# EAGLE board GTA04b7 (EAGLE 7.6.0), part 1 of 4
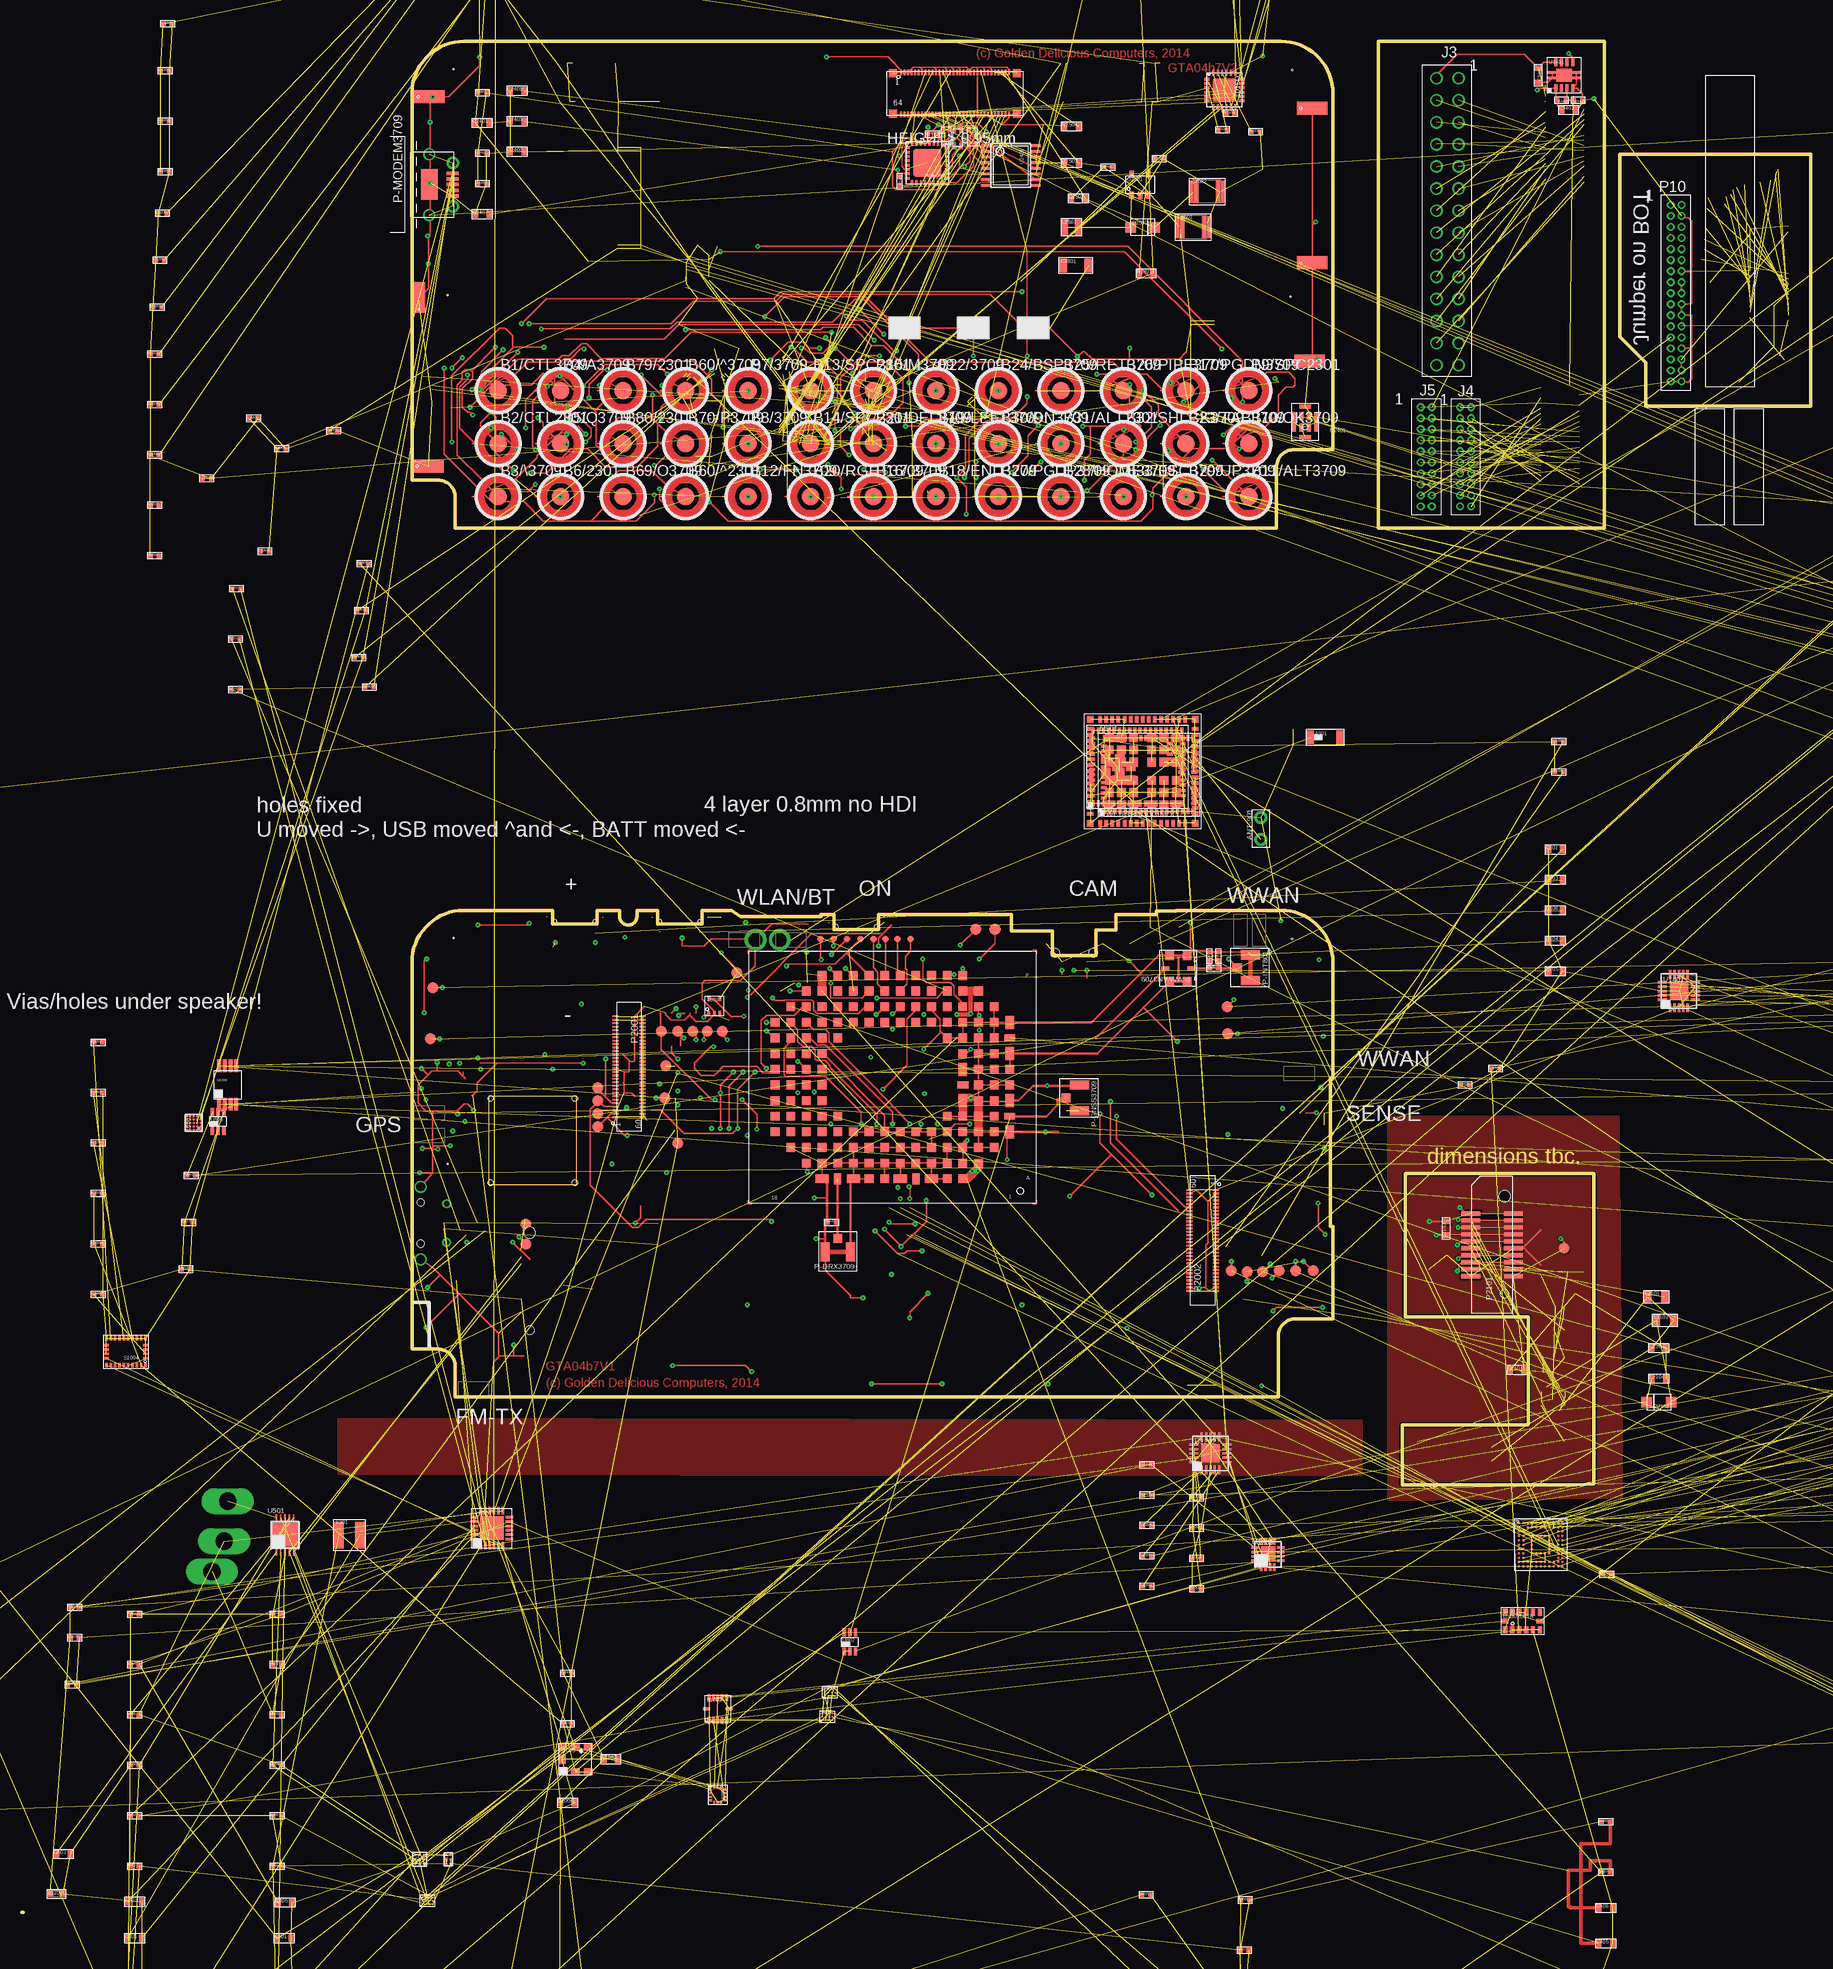
[diagram p42: board, top side]
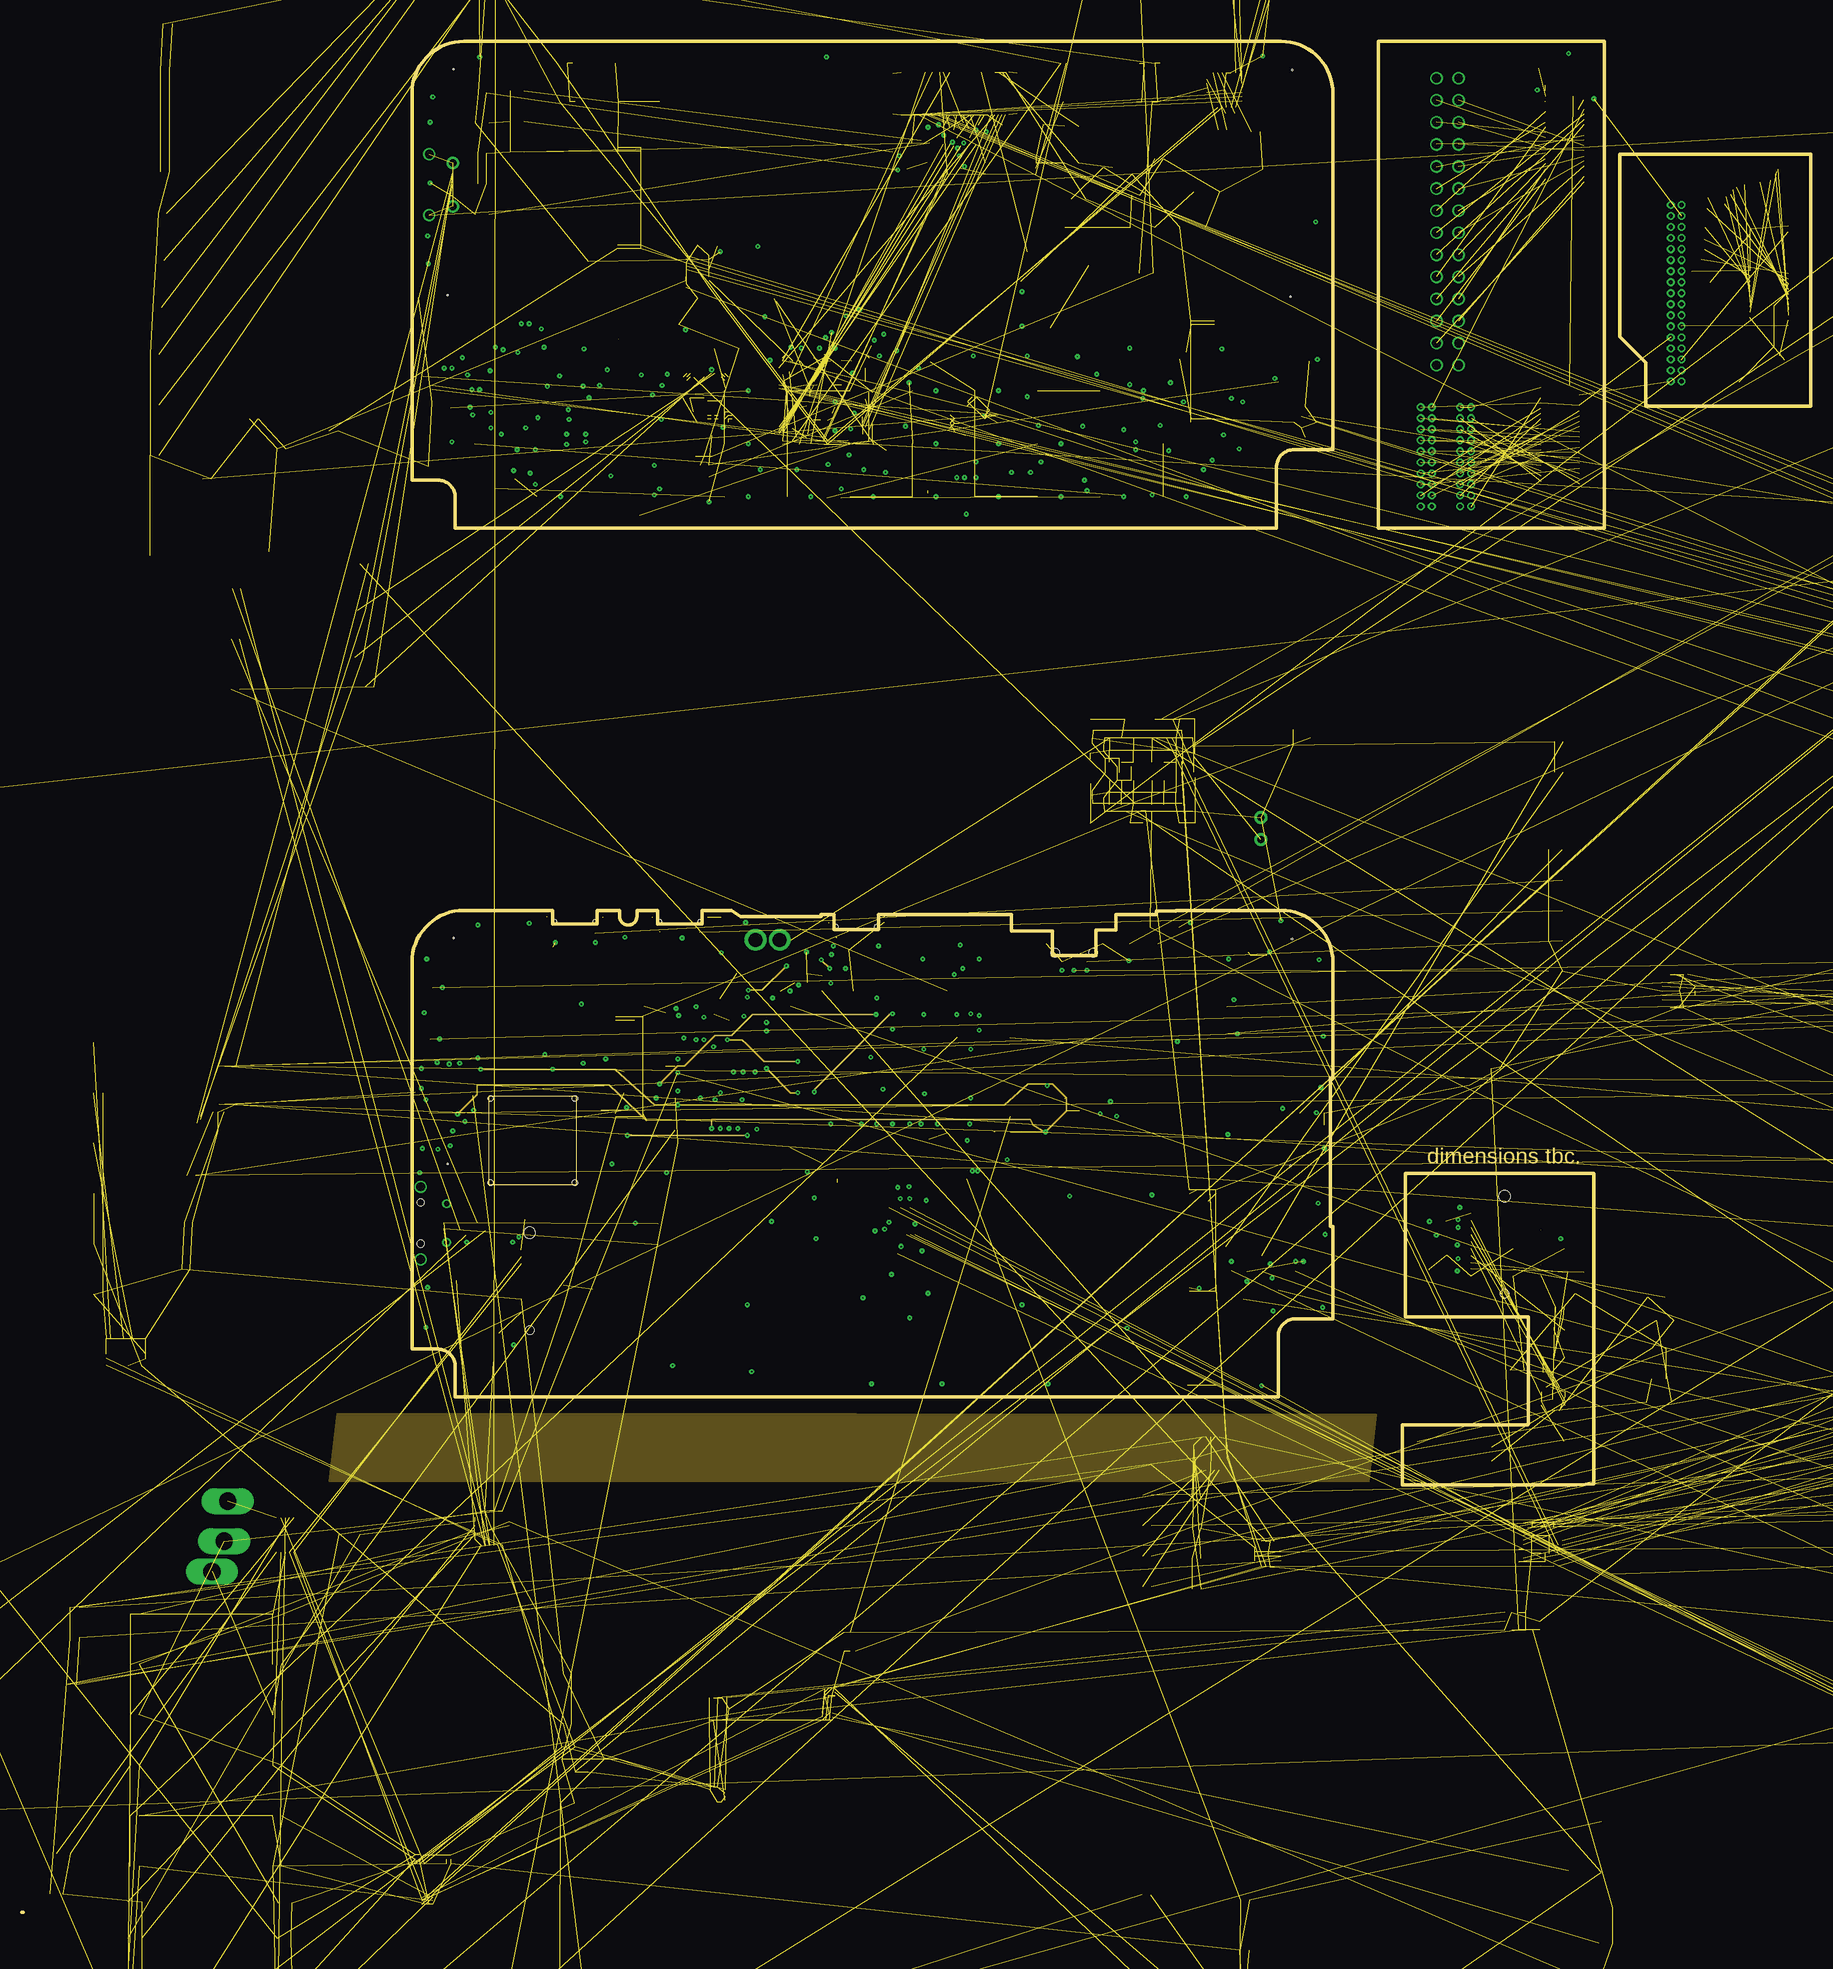
[diagram p43: board, inner layer Route2]
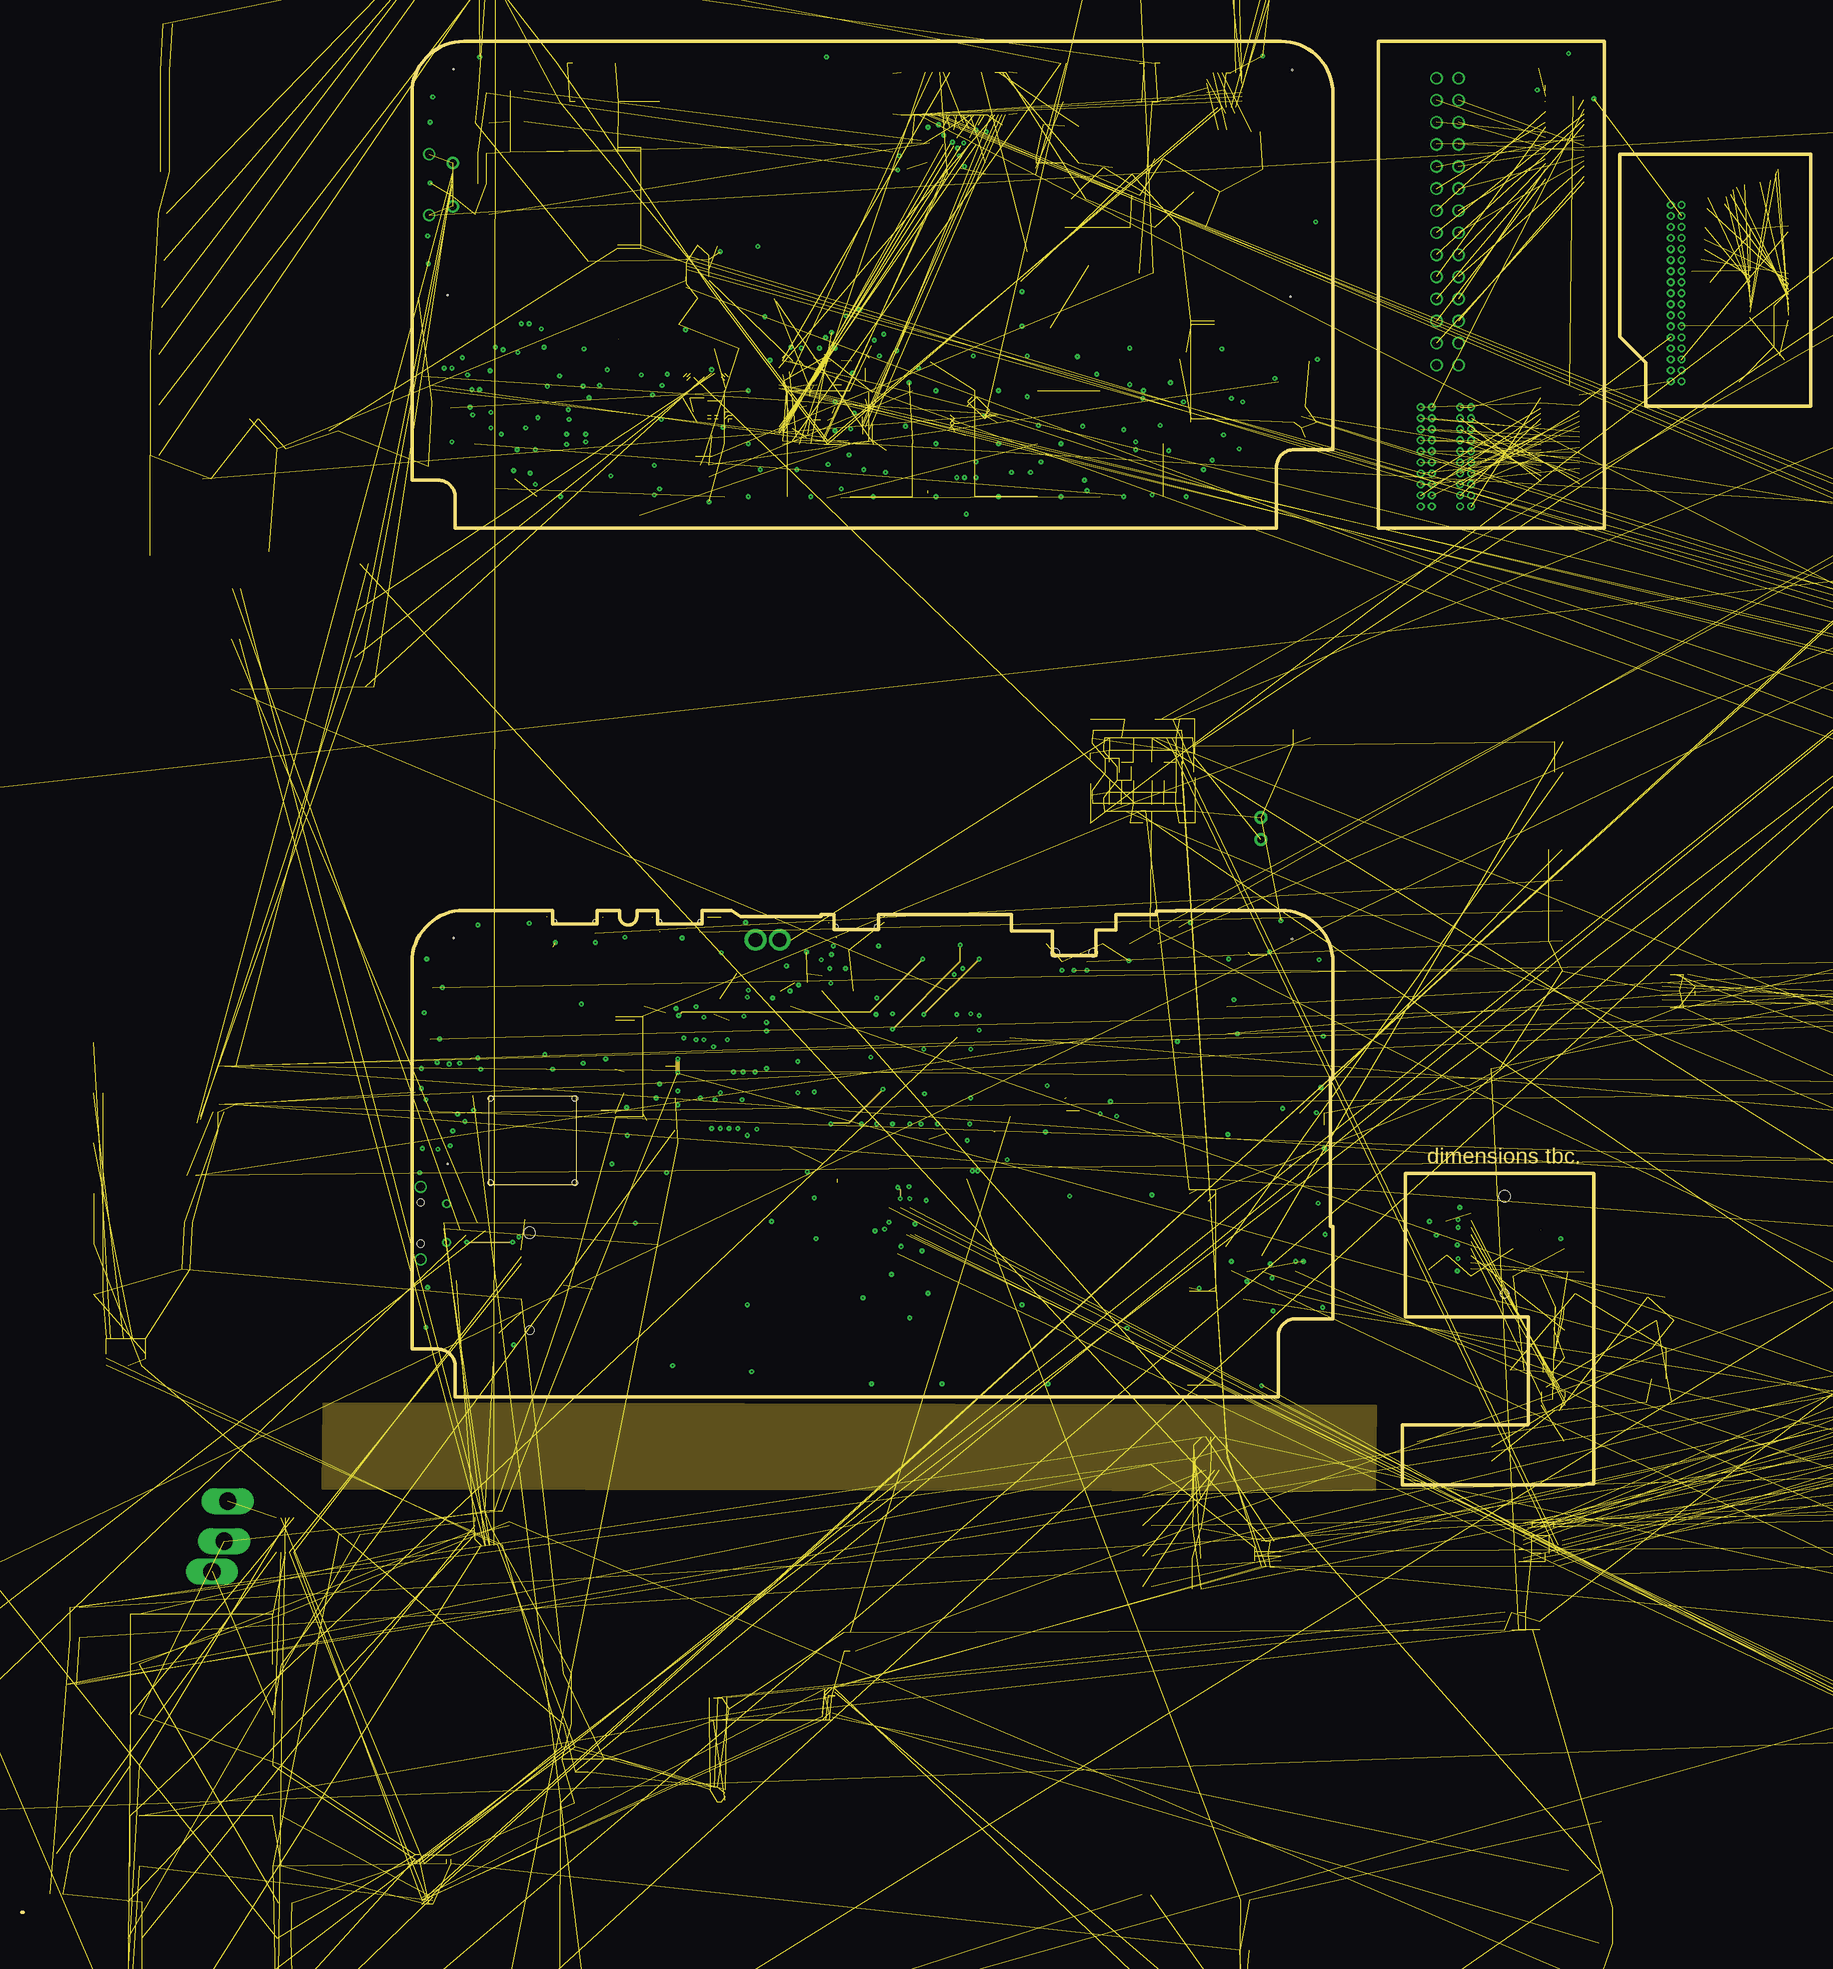
[diagram p44: board, inner layer Route15]
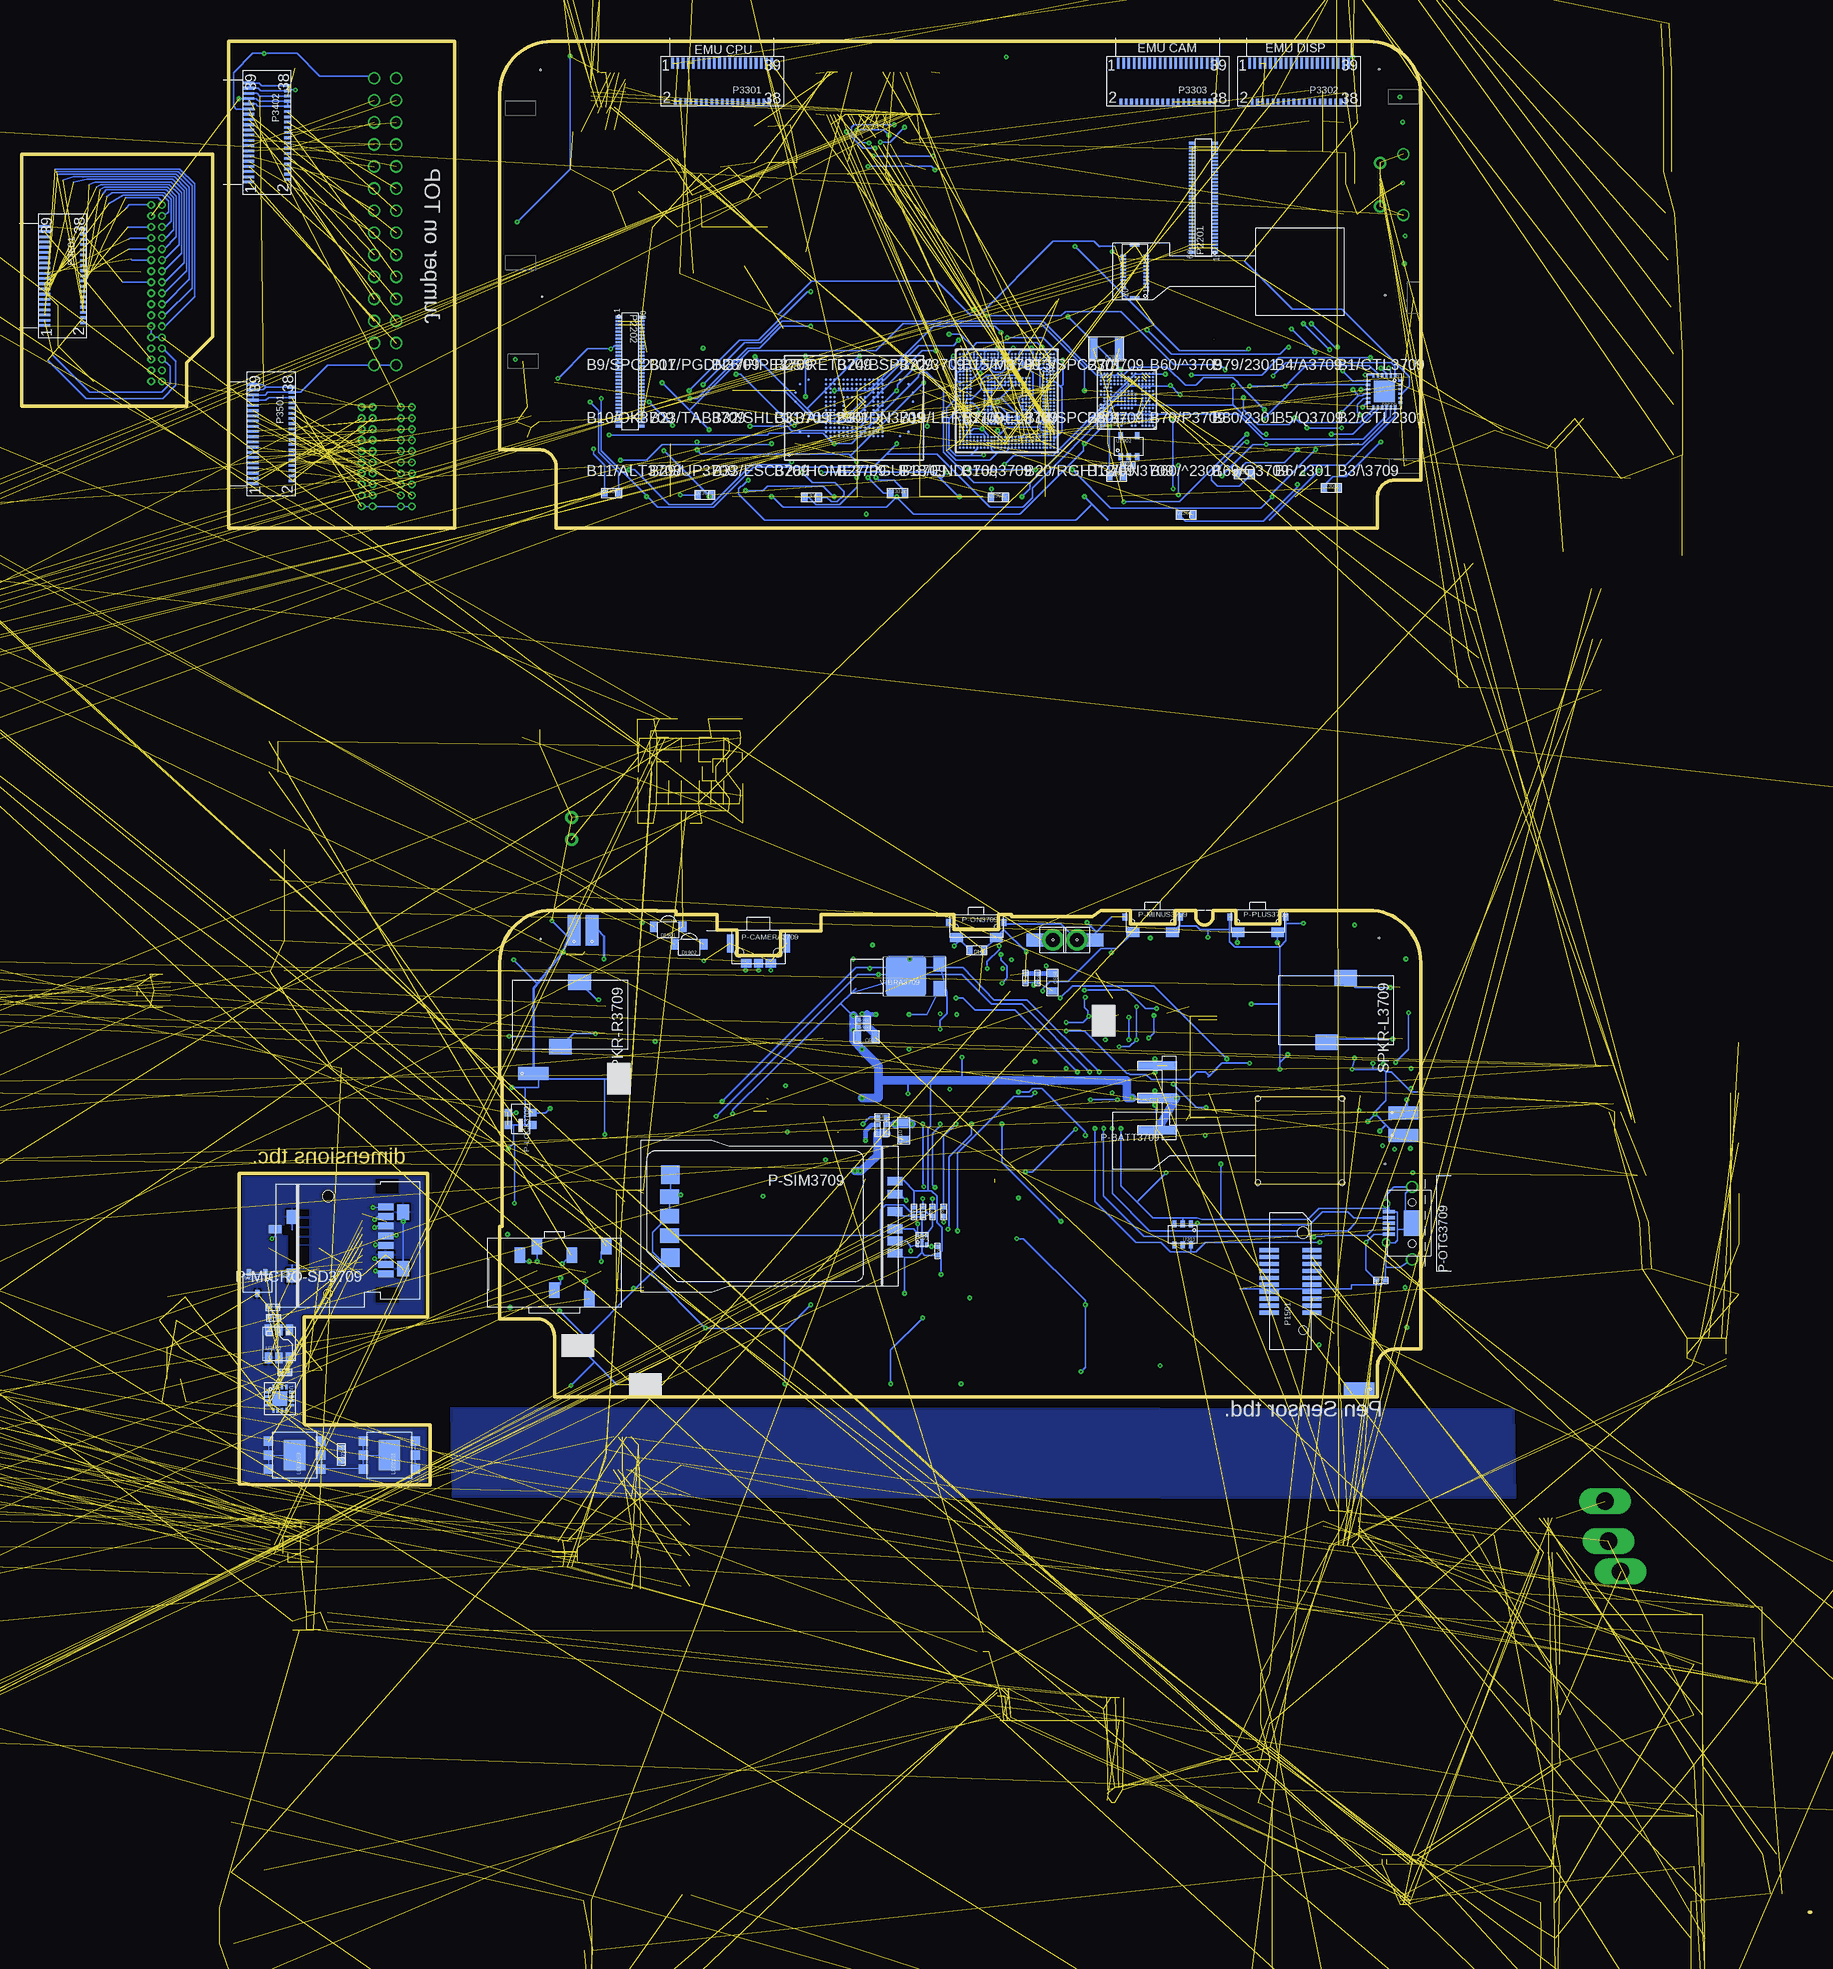
[diagram p45: board, bottom side, seen from below]

Size 205.9 x 215.3 mm. Coordinates in mm from the lower left corner, seen from the top.
Outline: 0,0 0.2,0
Outline: 49.9,59.3 144.6,59.3 144.6,66.3 arc-90 146.6,68.3 150.9,68.3 150.9,78.9 150.6,78.9 150.6,96 150.9,96 150.9,109.3 arc90 144.9,115.3 132.8,115.3 132.8,115.2 130.6,115.2 130.6,114.8 125.9,114.8 125.9,113 123.6,113 123.6,110.1 118.6,110.1 118.6,112.9 113.9,112.9 113.9,114.8 98.6,114.8 98.6,113.1 93.5,113.1 93.5,114.8 92,114.8 92,114.6 82.7,114.6 81.7,115.3 78.3,115.3 78.3,113.7 73.2,113.7 73.2,115.3 70.8,115.3 70.8,114.6 arc-180 68.8,114.6 68.8,115.3 66.2,115.3 66.2,113.7 61.1,113.7 61.1,115.3 50.9,115.3 arc90 44.9,109.3 44.9,64.8 47.9,64.8 arc-90 49.9,62.8 49.9,59.3
Outline: 159.2,85 180.9,85 180.9,49.3 178.9,49.2 158.9,49.2 158.9,56.1 173.3,56.1 173.4,56.2 173.4,68.5 159.2,68.5 159.2,85
Outline: 49.9,159.3 144.4,159.3 144.4,166.3 arc-90 146.4,168.3 150.9,168.3 150.9,209.3 arc90 144.9,215.3 50.9,215.3 arc90 44.9,209.3 44.9,164.8 47.9,164.8 arc-90 49.9,162.8 49.9,159.3
Outline: 156.1,215.3 182.1,215.3 182.1,159.3 156.1,159.3 156.1,215.3
Outline: 186.9,173.3 186.9,178.3 183.9,181.3 183.9,202.3 205.9,202.3 205.9,173.3 186.9,173.3
Copper layers (1*2*15*16): Top 0.035mm / dielectric 0.065mm / Route2 0.035mm / dielectric 0.53mm / Route15 0.035mm / dielectric 0.065mm / Bottom 0.035mm
Design rules "Würth *": minimum track width 0.1mm, minimum drill 0.25mm, track to track 0.1mm, track to pad 0.15mm, pad to pad 0.15mm, via to via 0.15mm, smd to smd 0.15mm, copper to edge 0.15mm, drill to drill 0.15mm, minimum pad ring 0.2mm, minimum via ring 0.2mm, stop-mask expansion 4mil, vias tented up to drill 0.4mm, thermal gap 10mil
Net classes: 2 50 Ohm: width 0.27 mm, clearance 0.27 mm; 3 90 Ohm: width 0.15 mm, clearance 0.27 mm; 4 GND: width 0.2 mm; 5 Battery: width 0.3 mm; 6 FM Antenna: width 0.27 mm; 7 VBUS: width 0.25 mm
Holes 0.15 mm at 49.7,112.1 146.2,112 146,85.9 49,86.1 49.7,212.1 146.2,212 146,185.9 49,186.1
tKeepout: area 94.4,180.7 to 115.4,203.7; area 115.4,180.7 to 140.4,212.7
bKeepout: area 51.4,59.3 to 144.4,63.8; area 47.1,110.7 to 51.3,113.7; area 68.6,109.5 to 71.2,114.6; area 52.3,110.6 to 59.2,114.8; area 45.7,87.7 to 49.2,94.4; area 81.1,110.1 to 91.9,114.4; area 100.3,108.6 to 101.1,114.3; area 112.5,109.1 to 113.2,114.4; area 127,109.2 to 127.6,114.4; area 127.6,109.2 to 133.1,110; area 133.1,109.7 to 134,115; area 137.7,110.3 to 145.1,114.8; area 47.8,84.1 to 51.4,87.7; area 45.2,69.9 to 48.2,70.6; area 49.6,87.9 to 50.1,101.5; area 136.5,68.3 to 150.8,78.9; area 135.2,99 to 150.1,107.9; area 47.3,99.1 to 61.8,108.5; area 140.1,80.1 to 150.4,100.2; area 106.4,71.1 to 123.4,72.1; area 106.4,88.1 to 123.4,89.1; area 82.9,181.3 to 116.9,211.3

## Footprints (pad centres in the part's own frame; a part is rotated, then mirrored left to right if it is on the bottom)
TP-0.75 = smd 0.75 x 0.75: P 0,0
2450AT18A100 = smd 0.8 x 1.6: ANT 0.4,0; NC 3.8,0 | smd 0.2 x 0.2: GND1 -1.6,0.9; GND2 -1.6,-0.9
2PIN2.54 = drill 0.8 pad 1.5: 1 -1.27,0; 2 1.27,0
N900-BUTTON = smd 2 x 2 rotated 60: P$1 0,0 | smd 0.7 x 0.2: P$2 -2.7,0
TP-1.25 = smd 1.25 x 1.25: P 0,0
1PIN-HOLE = drill 2 pad 3 long: P$1 0,0
SMD-0402 = smd 0.5 x 0.5: 1 -0.5,0; 2 0.5,0
SMD-0603 = smd 0.6 x 0.85: 1 -0.8,0; 2 0.8,0
SMD-0805 = smd 0.8 x 1.3: 1 -1,0; 2 1,0
MK325 = smd 1 x 2.5: 1 -1.5,0; 2 1.5,0
SMD-1206 = smd 0.9 x 1.6: 1 -1.45,0; 2 1.45,0
SMD-1210 = smd 0.9 x 2.5: 1 -1.45,0; 2 1.45,0
SMD-0603D = smd 0.6 x 0.85: A -0.8,0; K 0.8,0
VSMB2948SL = smd 0.9 x 1.2: A 1.65,0; K -1.65,0
CRS02 = smd 1.2 x 1.2: A -1.4,0; K 1.4,0
N900-SPRING-A = smd 3.5 x 1.5: 1 0,0
PAD-3.5X2.5 = smd 3.5 x 2.5: 1 0,0
SMD-1212 = smd 1.1 x 3: 1 -1.2,0; 2 1.2,0
MPZ1608 = smd 0.6 x 0.8: 1 -0.7,0; 2 0.7,0
LB2016 = smd 0.7 x 1.8: 1 -0.75,0; 2 0.75,0
ACM2012H = smd 0.75 x 0.4: 1 -0.925,0.4; 2 -0.925,-0.4; 3 0.925,-0.4; 4 0.925,0.4
SMD-0806 = smd 0.8 x 1.6: 1 -1,0; 2 1,0
CLN6A = smd 1.1 x 1.1: 1 -3,1.6; 2 -3,0; 3 -3,-1.6; 4 3,-1.6; 5 3,0; 6 3,1.6 | smd 2.5 x 3.5: HS 0,0
SMLP36RGB2W3 = smd 0.45 x 0.45: 1 -0.675,-0.425; 3 0.675,-0.425; 4 0.675,0.425; 6 -0.675,0.425 | smd 0.4 x 0.45: 2 0,-0.425; 5 0,0.425
MSL0201RGB = smd 0.6 x 0.9: 1 1.35,0.15; 4 -1.35,0.15 | smd 0.5 x 0.9: 2 0.4,0; 3 -0.4,0
P*S8 = smd 1 x 1: A4 8.1,-11.7; A5 6.3,-11.7; A9 -0.9,-11.7; A10 -2.7,-11.7; B3 9.9,-9.9; B4 8.1,-9.9; B5 6.3,-9.9; B6 4.5,-9.9; B7 2.7,-9.9; B8 0.9,-9.9; B9 -0.9,-9.9; B10 -2.7,-9.9; B11 -4.5,-9.9; B12 -6.3,-9.9; B13 -8.1,-9.9; B14 -9.9,-9.9; C2 11.7,-8.1; C3 9.9,-8.1; C4 8.1,-8.1; C5 6.3,-8.1; C6 4.5,-8.1; C7 2.7,-8.1; C8 0.9,-8.1; C9 -0.9,-8.1; C10 -2.7,-8.1; C11 -4.5,-8.1; C12 -6.3,-8.1; C13 -8.1,-8.1; C14 -9.9,-8.1; C15 -11.7,-8.1; D2 11.7,-6.3; D3 9.9,-6.3; D4 8.1,-6.3; D5 6.3,-6.3; D6 4.5,-6.3; D7 2.7,-6.3; D8 0.9,-6.3; D9 -0.9,-6.3; D10 -2.7,-6.3; D11 -4.5,-6.3; D12 -6.3,-6.3; D13 -8.1,-6.3; D14 -9.9,-6.3; D15 -11.7,-6.3; D16 -13.5,-6.3; E2 11.7,-4.5; E3 9.9,-4.5; E4 8.1,-4.5; E5 6.3,-4.5; E12 -6.3,-4.5; E13 -8.1,-4.5; E14 -9.9,-4.5; E15 -11.7,-4.5; E16 -13.5,-4.5; F2 11.7,-2.7; F3 9.9,-2.7; F13 -8.1,-2.7; F14 -9.9,-2.7; F15 -11.7,-2.7; F16 -13.5,-2.7; G1 13.5,-0.9; G2 11.7,-0.9; G3 9.9,-0.9; G13 -8.1,-0.9; G14 -9.9,-0.9; G15 -11.7,-0.9; G16 -13.5,-0.9; H1 13.5,0.9; H2 11.7,0.9; H3 9.9,0.9; H13 -8.1,0.9; H14 -9.9,0.9; H15 -11.7,0.9; H16 -13.5,0.9; J2 11.7,2.7; J3 9.9,2.7; J4 8.1,2.7; J13 -8.1,2.7; J14 -9.9,2.7; J15 -11.7,2.7; J16 -13.5,2.7; K2 11.7,4.5; K3 9.9,4.5; K4 8.1,4.5; K5 6.3,4.5; K12 -6.3,4.5; K13 -8.1,4.5; K14 -9.9,4.5; K15 -11.7,4.5; K16 -13.5,4.5; L2 11.7,6.3; L3 9.9,6.3; L4 8.1,6.3; L5 6.3,6.3; L6 4.5,6.3; L7 2.7,6.3; L8 0.9,6.3; L9 -0.9,6.3; L10 -2.7,6.3; L11 -4.5,6.3; L12 -6.3,6.3; L13 -8.1,6.3; L14 -9.9,6.3; L15 -11.7,6.3; L16 -13.5,6.3; M2 11.7,8.1; M3 9.9,8.1; M4 8.1,8.1; M5 6.3,8.1; M6 4.5,8.1; M7 2.7,8.1; M8 0.9,8.1; M9 -0.9,8.1; M10 -2.7,8.1; M11 -4.5,8.1; M12 -6.3,8.1; M13 -8.1,8.1; M14 -9.9,8.1; M15 -11.7,8.1; N3 9.9,9.9; N4 8.1,9.9; N5 6.3,9.9; N6 4.5,9.9; N7 2.7,9.9; N8 0.9,9.9; N9 -0.9,9.9; N10 -2.7,9.9; N11 -4.5,9.9; N12 -6.3,9.9; N13 -8.1,9.9; N14 -9.9,9.9; P4 8.1,11.7; P5 6.3,11.7; P6 4.5,11.7; P7 2.7,11.7; P8 0.9,11.7; P9 -0.9,11.7; P10 -2.7,11.7; P11 -4.5,11.7; P12 -6.3,11.7; P13 -8.1,11.7 | smd 1.5 x 1: A6 4.5,-11.7; A8 0.9,-11.7; A11 -4.5,-11.7; A13 -8.1,-11.7 | smd 0.8 x 1.25: A7 2.7,-11.7; A12 -6.3,-11.7 | smd 1 x 1.5: D1 13.5,-6.3; F1 13.5,-2.7; F4 8.1,-2.7; H4 8.1,0.9; J1 13.5,2.7; L1 13.5,6.3 | smd 1.25 x 0.8: E1 13.5,-4.5; G4 8.1,-0.9; K1 13.5,4.5
WL18XXMOD = smd 0.75 x 0.75: 1 -6.025,-5.975; 17 6.025,-5.975; 33 6.025,5.975; 49 -6.025,5.975 | smd 0.4 x 0.75: 2 -4.9,-5.975; 3 -4.2,-5.975; 4 -3.5,-5.975; 5 -2.8,-5.975; 6 -2.1,-5.975; 7 -1.4,-5.975; 8 -0.7,-5.975; 9 0,-5.975; 10 0.7,-5.975; 11 1.4,-5.975; 12 2.1,-5.975; 13 2.8,-5.975; 14 3.5,-5.975; 15 4.2,-5.975; 16 4.9,-5.975; 34 4.9,5.975; 35 4.2,5.975; 36 3.5,5.975; 37 2.8,5.975; 38 2.1,5.975; 39 1.4,5.975; 40 0.7,5.975; 41 0,5.975; 42 -0.7,5.975; 43 -1.4,5.975; 44 -2.1,5.975; 45 -2.8,5.975; 46 -3.5,5.975; 47 -4.2,5.975; 48 -4.9,5.975 | smd 0.75 x 0.4: 18 6.025,-4.9; 19 6.025,-4.2; 20 6.025,-3.5; 21 6.025,-2.8; 22 6.025,-2.1; 23 6.025,-1.4; 24 6.025,-0.7; 25 6.025,0; 26 6.025,0.7; 27 6.025,1.4; 28 6.025,2.1; 29 6.025,2.8; 30 6.025,3.5; 31 6.025,4.2; 32 6.025,4.9; 50 -6.025,4.9; 51 -6.025,4.2; 52 -6.025,3.5; 53 -6.025,2.8; 54 -6.025,2.1; 55 -6.025,1.4; 56 -6.025,0.7; 57 -6.025,0; 58 -6.025,-0.7; 59 -6.025,-1.4; 60 -6.025,-2.1; 61 -6.025,-2.8; 62 -6.025,-3.5; 63 -6.025,-4.2; 64 -6.025,-4.9 | smd 1 x 1: G1 -3.85,-3.85; G2 -2.45,-3.85; G3 -1.05,-3.85; G4 1.05,-3.85; G5 2.45,-3.85; G6 3.85,-3.85; G7 -3.85,-2.45; G8 -2.45,-2.45; G9 -1.05,-2.45; G10 1.05,-2.45; G11 2.45,-2.45; G12 3.85,-2.45; G13 -3.85,-1.05; G14 -2.45,-1.05; G15 -1.05,-1.05; G16 1.05,-1.05; G17 2.45,-1.05; G18 3.85,-1.05; G19 -3.85,1.05; G20 -2.45,1.05; G21 -1.05,1.05; G22 1.05,1.05; G23 2.45,1.05; G24 3.85,1.05; G25 -3.85,2.45; G26 -2.45,2.45; G27 -1.05,2.45; G28 1.05,2.45; G29 2.45,2.45; G30 3.85,2.45; G31 -3.85,3.85; G32 -2.45,3.85; G33 -1.05,3.85; G34 1.05,3.85; G35 2.45,3.85; G36 3.85,3.85
JORJIN-WG7351 = smd 0.35 x 0.7: 1 -5.1,-4.2; 2 -4.5,-4.2; 3 -3.9,-4.2; 4 -3.3,-4.2; 5 -2.7,-4.2; 6 -2.1,-4.2; 7 -1.5,-4.2; 8 -0.9,-4.2; 9 -0.3,-4.2; 10 0.3,-4.2; 11 0.9,-4.2; 12 1.5,-4.2; 13 2.1,-4.2; 14 2.7,-4.2; 15 3.3,-4.2; 16 3.9,-4.2; 17 4.5,-4.2; 18 5.1,-4.2; 31 5.1,4.2; 32 4.5,4.2; 33 3.9,4.2; 34 3.3,4.2; 35 2.7,4.2; 36 2.1,4.2; 37 1.5,4.2; 38 0.9,4.2; 39 0.3,4.2; 40 -0.3,4.2; 41 -0.9,4.2; 42 -1.5,4.2; 43 -2.1,4.2; 44 -2.7,4.2; 45 -3.3,4.2; 46 -3.9,4.2; 47 -4.5,4.2; 48 -5.1,4.2 | smd 0.63 x 0.35: 19 5.2,-3.3; 20 5.2,-2.7; 21 5.2,-2.1; 22 5.2,-1.5; 23 5.2,-0.9; 24 5.2,-0.3; 25 5.2,0.3; 26 5.2,0.9; 27 5.2,1.5; 28 5.2,2.1; 29 5.2,2.7; 30 5.2,3.3; 49 -5.2,3.3; 50 -5.2,2.7; 51 -5.2,2.1; 52 -5.2,1.5; 53 -5.2,0.9; 54 -5.2,0.3; 55 -5.2,-0.3; 56 -5.2,-0.9; 57 -5.2,-1.5; 58 -5.2,-2.1; 59 -5.2,-2.7; 60 -5.2,-3.3 | smd 0.7 x 0.35: 61 3.735,0.3; 62 3.735,0.9; 63 3.735,1.5; 64 3.735,2.1; 65 3.735,2.7 | smd 1.1 x 1.1: 66 -3.665,-0.65; 67 -2.065,-0.65; 68 -2.065,0.95; 69 -3.665,0.95
SPK0415HM4H-B = smd 0.45 x 0.95: 1 0.425,-0.675; 2 0.425,0.675; 3 -0.425,0.675; 4 -0.425,-0.675 | smd 1.3 x 0.45: 5 0,-1.775; 7 0,1.775 | smd 0.45 x 2.3: 6 1.275,0; 8 -1.275,0
0R = smd 0.2 x 0.2: P$1 -0.15,0; P$2 0.15,0
N97-CAMERA = hole 0.6: -4.85,4.85; 4.85,4.85; 4.85,-4.85; -4.85,-4.85
FX6-20S-0.8SV = smd 0.5 x 2.2: 1 3.6,-2.45; 2 3.6,2.45; 3 2.8,-2.45; 4 2.8,2.45; 5 2,-2.45; 6 2,2.45; 7 1.2,-2.45; 8 1.2,2.45; 9 0.4,-2.45; 10 0.4,2.45; 11 -0.4,-2.45; 12 -0.4,2.45; 13 -1.2,-2.45; 14 -1.2,2.45; 15 -2,-2.45; 16 -2,2.45; 17 -2.8,-2.45; 18 -2.8,2.45; 19 -3.6,-2.45; 20 -3.6,2.45 | hole 1: -5.6,-1.45 | hole 1.3: 5.6,-1.45
DF40C-60DS-0.4V = smd 0.2 x 0.7: 1 5.8,-1.54; 2 5.4,-1.54; 3 5,-1.54; 4 4.6,-1.54; 5 4.2,-1.54; 6 3.8,-1.54; 7 3.4,-1.54; 8 3,-1.54; 9 2.6,-1.54; 10 2.2,-1.54; 11 1.8,-1.54; 12 1.4,-1.54; 13 1,-1.54; 14 0.6,-1.54; 15 0.2,-1.54; 16 -0.2,-1.54; 17 -0.6,-1.54; 18 -1,-1.54; 19 -1.4,-1.54; 20 -1.8,-1.54; 21 -2.2,-1.54; 22 -2.6,-1.54; 23 -3,-1.54; 24 -3.4,-1.54; 25 -3.8,-1.54; 26 -4.2,-1.54; 27 -4.6,-1.54; 28 -5,-1.54; 29 -5.4,-1.54; 30 -5.8,-1.54; 31 -5.8,1.54; 32 -5.4,1.54; 33 -5,1.54; 34 -4.6,1.54; 35 -4.2,1.54; 36 -3.8,1.54; 37 -3.4,1.54; 38 -3,1.54; 39 -2.6,1.54; 40 -2.2,1.54; 41 -1.8,1.54; 42 -1.4,1.54; 43 -1,1.54; 44 -0.6,1.54; 45 -0.2,1.54; 46 0.2,1.54; 47 0.6,1.54; 48 1,1.54; 49 1.4,1.54; 50 1.8,1.54; 51 2.2,1.54; 52 2.6,1.54; 53 3,1.54; 54 3.4,1.54; 55 3.8,1.54; 56 4.2,1.54; 57 4.6,1.54; 58 5,1.54; 59 5.4,1.54; 60 5.8,1.54
FX6-20P-0.8SV = smd 0.5 x 2.2: 1 3.6,2.45; 2 3.6,-2.45; 3 2.8,2.45; 4 2.8,-2.45; 5 2,2.45; 6 2,-2.45; 7 1.2,2.45; 8 1.2,-2.45; 9 0.4,2.45; 10 0.4,-2.45; 11 -0.4,2.45; 12 -0.4,-2.45; 13 -1.2,2.45; 14 -1.2,-2.45; 15 -2,2.45; 16 -2,-2.45; 17 -2.8,2.45; 18 -2.8,-2.45; 19 -3.6,2.45; 20 -3.6,-2.45 | hole 1: -5.6,-1.45 | hole 1.3: 5.6,-1.45
DF40C-60DP-0.4V = smd 0.23 x 0.66: 1 5.8,1.335; 2 5.4,1.335; 3 5,1.335; 4 4.6,1.335; 5 4.2,1.335; 6 3.8,1.335; 7 3.4,1.335; 8 3,1.335; 9 2.6,1.335; 10 2.2,1.335; 11 1.8,1.335; 12 1.4,1.335; 13 1,1.335; 14 0.6,1.335; 15 0.2,1.335; 16 -0.2,1.335; 17 -0.6,1.335; 18 -1,1.335; 19 -1.4,1.335; 20 -1.8,1.335; 21 -2.2,1.335; 22 -2.6,1.335; 23 -3,1.335; 24 -3.4,1.335; 25 -3.8,1.335; 26 -4.2,1.335; 27 -4.6,1.335; 28 -5,1.335; 29 -5.4,1.335; 30 -5.8,1.335; 31 -5.8,-1.335; 32 -5.4,-1.335; 33 -5,-1.335; 34 -4.6,-1.335; 35 -4.2,-1.335; 36 -3.8,-1.335; 37 -3.4,-1.335; 38 -3,-1.335; 39 -2.6,-1.335; 40 -2.2,-1.335; 41 -1.8,-1.335; 42 -1.4,-1.335; 43 -1,-1.335; 44 -0.6,-1.335; 45 -0.2,-1.335; 46 0.2,-1.335; 47 0.6,-1.335; 48 1,-1.335; 49 1.4,-1.335; 50 1.8,-1.335; 51 2.2,-1.335; 52 2.6,-1.335; 53 3,-1.335; 54 3.4,-1.335; 55 3.8,-1.335; 56 4.2,-1.335; 57 4.6,-1.335; 58 5,-1.335; 59 5.4,-1.335; 60 5.8,-1.335 | smd 0.35 x 0.66: M1 6.275,1.335; M2 -6.275,1.335; M3 -6.275,-1.335; M4 6.275,-1.335
DF37NB-20SD-0.4V = smd 0.23 x 0.63: 1 -1.8,-1.325; 2 -1.4,-1.325; 3 -1,-1.325; 4 -0.6,-1.325; 5 -0.2,-1.325; 6 0.2,-1.325; 7 0.6,-1.325; 8 1,-1.325; 9 1.4,-1.325; 10 1.8,-1.325; 11 1.8,1.325; 12 1.4,1.325; 13 1,1.325; 14 0.6,1.325; 15 0.2,1.325; 16 -0.2,1.325; 17 -0.6,1.325; 18 -1,1.325; 19 -1.4,1.325; 20 -1.8,1.325 | smd 0.38 x 1.1: M1 -3.04,0; M2 3.04,0
FH23-39S-0.3SHW(0.5) = smd 0.3 x 1.25: 1 5.7,-2.062; 3 5.1,-2.062; 5 4.5,-2.062; 7 3.9,-2.062; 9 3.3,-2.062; 11 2.7,-2.062; 13 2.1,-2.062; 15 1.5,-2.062; 17 0.9,-2.062; 19 0.3,-2.062; 21 -0.3,-2.062; 23 -0.9,-2.062; 25 -1.5,-2.062; 27 -2.1,-2.062; 29 -2.7,-2.062; 31 -3.3,-2.062; 33 -3.9,-2.062; 35 -4.5,-2.062; 37 -5.1,-2.062; 39 -5.7,-2.062 | smd 0.3 x 0.7: 2 5.4,2.362; 4 4.8,2.362; 6 4.2,2.362; 8 3.6,2.362; 10 3,2.362; 12 2.4,2.362; 14 1.8,2.362; 16 1.2,2.362; 18 0.6,2.362; 20 0,2.362; 22 -0.6,2.362; 24 -1.2,2.362; 26 -1.8,2.362; 28 -2.4,2.362; 30 -3,2.362; 32 -3.6,2.362; 34 -4.2,2.362; 36 -4.8,2.362; 38 -5.4,2.362
BEAGLEBOARD = drill 1.02: J3$1 1.45,-37.85; J3$2 3.99,-37.85; J3$3 1.45,-35.31; J3$4 3.99,-35.31; J3$5 1.45,-32.77; J3$6 3.99,-32.77; J3$7 1.45,-30.23; J3$8 3.99,-30.23; J3$9 1.45,-27.69; J3$10 3.99,-27.69; J3$11 1.45,-25.15; J3$12 3.99,-25.15; J3$13 1.45,-22.61; J3$14 3.99,-22.61; J3$15 1.45,-20.07; J3$16 3.99,-20.07; J3$17 1.45,-17.53; J3$18 3.99,-17.53; J3$19 1.45,-14.99; J3$20 3.99,-14.99; J3$21 1.45,-12.45; J3$22 3.99,-12.45; J3$23 1.45,-9.91; J3$24 3.99,-9.91; J3$25 1.45,-7.37; J3$26 3.99,-7.37; J3$27 1.45,-4.83; J3$28 3.99,-4.83 | drill 0.5: J4$1 1.27,0; J4$2 0,0; J4$3 1.27,1.27; J4$4 0,1.27; J4$5 1.27,2.54; J4$6 0,2.54; J4$7 1.27,3.81; J4$8 0,3.81; J4$9 1.27,5.08; J4$10 0,5.08; J4$11 1.27,6.35; J4$12 0,6.35; J4$13 1.27,7.62; J4$14 0,7.62; J4$15 1.27,8.89; J4$16 0,8.89; J4$17 1.27,10.16; J4$18 0,10.16; J4$19 1.27,11.43; J4$20 0,11.43; J5$1 5.8,0; J5$2 4.53,0; J5$3 5.8,1.27; J5$4 4.53,1.27; J5$5 5.8,2.54; J5$6 4.53,2.54; J5$7 5.8,3.81; J5$8 4.53,3.81; J5$9 5.8,5.08; J5$10 4.53,5.08; J5$11 5.8,6.35; J5$12 4.53,6.35; J5$13 5.8,7.62; J5$14 4.53,7.62; J5$15 5.8,8.89; J5$16 4.53,8.89; J5$17 5.8,10.16; J5$18 4.53,10.16; J5$19 5.8,11.43; J5$20 4.53,11.43
BEAGLEBOARD-XM-CAM = drill 0.5: P10$1 9.63,-24.47; P10$2 8.4,-24.47; P10$3 9.63,-23.2; P10$4 8.4,-23.2; P10$5 9.63,-21.93; P10$6 8.4,-21.93; P10$7 9.63,-20.66; P10$8 8.4,-20.66; P10$9 9.63,-19.39; P10$10 8.4,-19.39; P10$11 9.63,-18.12; P10$12 8.4,-18.12; P10$13 9.63,-16.85; P10$14 8.4,-16.85; P10$15 9.63,-15.58; P10$16 8.4,-15.58; P10$17 9.63,-14.31; P10$18 8.4,-14.31; P10$19 9.63,-13.04; P10$20 8.4,-13.04; P10$21 9.63,-11.77; P10$22 8.4,-11.77; P10$23 9.63,-10.5; P10$24 8.4,-10.5; P10$25 9.63,-9.23; P10$26 8.4,-9.23; P10$27 9.63,-7.96; P10$28 8.4,-7.96; P10$29 9.63,-6.69; P10$30 8.4,-6.69; P10$31 9.63,-5.42; P10$32 8.4,-5.42; P10$33 9.63,-4.15; P10$34 8.4,-4.15
N900-BATTCONN = smd 4.5 x 1: BATT1 0,3.7; BATT2 0,0; BATT3 0,-3.7
EVQQ0 = smd 1.2 x 1: 1 -1.4,-0.9; 3 1.4,-0.9 | smd 1 x 1: 2 0,-0.9 | smd 0.7 x 2.05: S1 -3.25,1.375; S2 3.25,1.375 | hole 1: -2.2,0.3; 2.2,0.3
500024-6471 = smd 0.23 x 0.65: 1 6.2,-2.425; 2 5.8,-2.425; 3 5.4,-2.425; 4 5,-2.425; 5 4.6,-2.425; 6 4.2,-2.425; 7 3.8,-2.425; 8 3.4,-2.425; 9 3,-2.425; 10 2.6,-2.425; 11 2.2,-2.425; 12 1.8,-2.425; 13 1.4,-2.425; 14 1,-2.425; 15 0.6,-2.425; 16 0.2,-2.425; 17 -0.2,-2.425; 18 -0.6,-2.425; 19 -1,-2.425; 20 -1.4,-2.425; 21 -1.8,-2.425; 22 -2.2,-2.425; 23 -2.6,-2.425; 24 -3,-2.425; 25 -3.4,-2.425; 26 -3.8,-2.425; 27 -4.2,-2.425; 28 -4.6,-2.425; 29 -5,-2.425; 30 -5.4,-2.425; 31 -5.8,-2.425; 32 -6.2,-2.425; 33 -6.2,2.425; 34 -5.8,2.425; 35 -5.4,2.425; 36 -5,2.425; 37 -4.6,2.425; 38 -4.2,2.425; 39 -3.8,2.425; 40 -3.4,2.425; 41 -3,2.425; 42 -2.6,2.425; 43 -2.2,2.425; 44 -1.8,2.425; 45 -1.4,2.425; 46 -1,2.425; 47 -0.6,2.425; 48 -0.2,2.425; 49 0.2,2.425; 50 0.6,2.425; 51 1,2.425; 52 1.4,2.425; 53 1.8,2.425; 54 2.2,2.425; 55 2.6,2.425; 56 3,2.425; 57 3.4,2.425; 58 3.8,2.425; 59 4.2,2.425; 60 4.6,2.425; 61 5,2.425; 62 5.4,2.425; 63 5.8,2.425; 64 6.2,2.425 | smd 0.9 x 0.9: M1 -7.12,-2.32; M2 -7.12,2.32; M3 7.12,-2.32; M4 7.12,2.32
U.FL-SOCKET-SMT-HIROSE = smd 1.05 x 2.2: GND1 -1.475,0; GND2 1.475,0 | smd 1 x 1.05: SIG 0,-1.525
N900-HEADSET = smd 1.2 x 1.8: 1 -6,-3; 2 -4,3; 3 -2,-2; 4 0,2; 5 2,-3; 6 4,-2
ESE-16J001 = smd 0.9 x 0.9: 1 -0.7,1.4; 2 0.7,1.4; 3 -0.7,-1.4; 4 0.7,-1.4
ST1W008S4BR1500 = smd 1.8 x 0.8: 1 -4,-3.85; 2 -4,-2.75; 3 -4,-1.65; 4 -4,-0.55; 5 -4,0.55; 6 -4,1.65; 7 -4,2.75; 8 -4,3.85 | smd 1.4 x 1.8: S1 -6,3.25; S2 -6,-3.25 | smd 1.2 x 1.6: S3 6.8,4; S4 6.8,-2.7 | smd 1.5 x 1: SW 8.75,-1.3
EVQP40B3M = smd 1.45 x 1.05: 1 -2.275,-0.925; 2 2.275,-0.925 | smd 0.6 x 0.8: S1 -3.2,0.8; S2 3.2,0.8 | hole 0.5: -2.35,0.3; 2.35,0.3
105017-0001 = smd 0.4 x 1.35: 1/VBUS 1.3,-2.7; 2/D- 0.65,-2.7; 3/D+ 0,-2.7; 4/ID -0.65,-2.7; 5/GND -1.3,-2.7 | smd 3.5 x 1.9: MOUNT 0,0 | drill 0.85 pad 1.45: SH1 -2.5,-2.7; SH2 2.5,-2.7 | drill 1 pad 1.3: SH3 -3.5,0; SH4 3.5,0
SD-47590-0001 = smd 0.4 x 1.35: 1/VBUS 1.3,-2.675; 2/D- 0.65,-2.675; 3/D+ 0,-2.675; 4/ID -0.65,-2.675; 5/GND -1.3,-2.675 | smd 2.9 x 1.9: MOUNT 0,0 | drill 0.6 pad 0.8: SH1 -2.225,-3; SH2 2.225,-3 | drill 1 pad 1.3: SH3 -4.175,0; SH4 4.175,0 | hole 0.85: -2.375,0; 2.375,0
SJ106220 = smd 1.7 x 1: C1 12.11,2.54; C2 12.11,0.54; C3 12.11,-1.46; CD 12.11,-2.86; CD-G1 12.11,4.04; CD-G2 12.11,-4.26 | smd 2.2 x 1.7: C5 -13.84,2.24; C6 -13.84,0; C7 -13.84,-2.24 | smd 2.1 x 2.1: S1 -13.75,4.78; S2 -13.75,-4.78
SWD-SOCKETSWITCH-SMT-MURATA = smd 1 x 1: GND1 -1.5,1; GND2 -1.5,-1; GND3 1.5,-1; GND4 1.5,1 | smd 0.5 x 0.9: IN 0,-1.5; OUT 0,1.5
LGA-DIL-12+2 = smd 0.5 x 0.8: 1 -2,-1; 2 -1.2,-1; 3 -0.4,-1; 4 0.4,-1; 5 1.2,-1; 6 2,-1; 8 2,1; 9 1.2,1; 10 0.4,1; 11 -0.4,1; 12 -1.2,1; 13 -2,1 | smd 0.8 x 0.5: 7 2,0; 14 -2,0
BMG160 = smd 0.32 x 0.8: 1 -1,-1.3; 2 -0.5,-1.3; 3 0,-1.3; 4 0.5,-1.3; 5 1,-1.3; 7 1,1.3; 8 0.5,1.3; 9 0,1.3; 10 -0.5,1.3; 11 -1,1.3 | smd 0.8 x 0.32: 6 1.3,0; 12 -1.3,0
BMC150 = smd 0.375 x 0.225: 1 -0.863,0.6; 2 -0.863,0.2; 3 -0.863,-0.2; 4 -0.863,-0.6; 8 0.863,-0.6; 9 0.863,-0.2; 10 0.863,0.2; 11 0.863,0.6 | smd 0.225 x 0.375: 5 -0.4,-0.863; 6 0,-0.863; 7 0.4,-0.863; 12 0.4,0.863; 13 0,0.863; 14 -0.4,0.863
BNO050 = smd 0.28 x 0.5: 1 2.25,-1.56; 6 2.25,1.56; 7 1.75,1.56; 8 1.25,1.56; 9 0.75,1.56; 10 0.25,1.56; 11 -0.25,1.56; 12 -0.75,1.56; 13 -1.25,1.56; 14 -1.75,1.56; 15 -2.25,1.56; 20 -2.25,-1.56; 21 -1.75,-1.56; 22 -1.25,-1.56; 23 -0.75,-1.56; 24 -0.25,-1.56; 25 0.25,-1.56; 26 0.75,-1.56; 27 1.25,-1.56; 28 1.75,-1.56 | smd 0.5 x 0.28: 2 2.25,-0.75; 3 2.25,-0.25; 4 2.25,0.25; 5 2.25,0.75; 16 -2.25,0.75; 17 -2.25,0.25; 18 -2.25,-0.25; 19 -2.25,-0.75
BMP180 = smd 1 x 0.8: 1 -1.5,-1.45; 2 0,-1.45; 3 1.5,-1.45; 4 1.5,1.45; 5 0,1.45; 6 -1.5,1.45 | smd 0.8 x 1: 7 -1.5,0
2403-260-00031 = smd 1.8 x 2.6: + -3.7,1.1; - 3.7,-1.1
SC88A = smd 0.3 x 0.5: 1 -0.65,-0.838; 2 0,-0.838; 3 0.65,-0.838; 4 0.65,0.838; 5 -0.65,0.838
SC89-3 = smd 0.5 x 0.66: 1 0.5,0.57; 2 -0.5,0.57; 3 0,-0.57
1PIN-1.5-0.8 = drill 0.8 pad 1.5: 1 0,0
1PIN-1.5SQ-0.8 = drill 0.8 pad 1.5 square: 1 0,0
SOT457-6 = smd 0.5 x 0.8: 1 -0.95,-1.2; 2 0,-1.2; 3 0.95,-1.2; 4 0.95,1.2; 5 0,1.2; 6 -0.95,1.2
S-PVQFN-N24-0.5 = smd 0.28 x 0.85: 1 -1.25,-2; 2 -0.75,-2; 3 -0.25,-2; 4 0.25,-2; 5 0.75,-2; 6 1.25,-2; 13 1.25,2; 14 0.75,2; 15 0.25,2; 16 -0.25,2; 17 -0.75,2; 18 -1.25,2 | smd 0.85 x 0.28: 7 2,-1.25; 8 2,-0.75; 9 2,-0.25; 10 2,0.25; 11 2,0.75; 12 2,1.25; 19 -2,1.25; 20 -2,0.75; 21 -2,0.25; 22 -2,-0.25; 23 -2,-0.75; 24 -2,-1.25 | smd 2.7 x 2.7: E 0,0
R-XBGA-N6-0.5 = smd 0.275 x 0.275: A1 0.25,-0.5; A2 -0.25,-0.5; B1 0.25,0; B2 -0.25,0; C1 0.25,0.5; C2 -0.25,0.5
R-XBGA-N12-0.4 = smd 0.25 x 0.25: A1 -0.6,-0.4; A2 -0.6,0; A3 -0.6,0.4; B1 -0.2,-0.4; B2 -0.2,0; B3 -0.2,0.4; C1 0.2,-0.4; C2 0.2,0; C3 0.2,0.4; D1 0.6,-0.4; D2 0.6,0; D3 0.6,0.4
S-PVSON-N10-4X3 = smd 0.28 x 0.85: 1 -1,-1.975; 2 -0.5,-1.975; 3 0,-1.975; 4 0.5,-1.975; 5 1,-1.975; 6 1,1.975; 7 0.5,1.975; 8 0,1.975; 9 -0.5,1.975; 10 -1,1.975 | smd 3 x 2.65: EXP 0,0
S-XBGA-N9-0.5 = smd 0.275 x 0.275: A1 0.5,-0.5; A2 0,-0.5; A3 -0.5,-0.5; B1 0.5,0; B2 0,0; B3 -0.5,0; C1 0.5,0.5; C2 0,0.5; C3 -0.5,0.5
SOT666IP = smd 0.3 x 0.59: 1 -0.5,-0.605; 3 0.5,-0.605; 4 0.5,0.605; 5 0,0.605; 6 -0.5,0.605 | smd 0.3 x 1: 2 0,-0.4
S-PWQFN-N20-0.5 = smd 0.28 x 1: 1 -1,-1.9; 2 -0.5,-1.9; 3 0,-1.9; 4 0.5,-1.9; 5 1,-1.9; 11 1,1.9; 12 0.5,1.9; 13 0,1.9; 14 -0.5,1.9; 15 -1,1.9 | smd 1 x 0.28: 6 1.9,-1; 7 1.9,-0.5; 8 1.9,0; 9 1.9,0.5; 10 1.9,1; 16 -1.9,1; 17 -1.9,0.5; 18 -1.9,0; 19 -1.9,-0.5; 20 -1.9,-1 | smd 2.15 x 2.15: E 0.03,0.04
TSNP-7-10 = smd 0.28 x 0.5: 1 -0.54,-1.09; 2 0,-1.09; 3 0.54,-1.09; 4 0.54,1.09; 5 0,1.09; 6 -0.54,1.09 | smd 1.42 x 1.1: 7 0,0
SC70-6 = smd 0.4 x 0.9: 1 -0.65,-1.1; 2 0,-1.1; 3 0.65,-1.1; 4 0.65,1.1; 5 0,1.1; 6 -0.65,1.1
SOT23-6 = smd 0.5 x 0.8: 1 -0.95,-1.2; 2 0,-1.2; 3 0.95,-1.2; 4 0.95,1.2; 5 0,1.2; 6 -0.95,1.2
QFN-16+4+E-0.5 = smd 0.34 x 0.34: 1 -1.265,1.265; 6 -1.265,-1.265; 11 1.265,-1.265; 16 1.265,1.265 | smd 0.61 x 0.28: 2 -1.355,0.75; 3 -1.355,0.25; 4 -1.355,-0.25; 5 -1.355,-0.75; 12 1.355,-0.75; 13 1.355,-0.25; 14 1.355,0.25; 15 1.355,0.75 | smd 0.28 x 0.61: 7 -0.75,-1.355; 8 -0.25,-1.355; 9 0.25,-1.355; 10 0.75,-1.355; 17 0.75,1.355; 18 0.25,1.355; 19 -0.25,1.355; 20 -0.75,1.355 | smd 1.7 x 1.7: EXP 0,0
S-PBGA-N87-0.5 = smd 0.275 x 0.275: A1 -2.5,2.5; A2 -2,2.5; A3 -1.5,2.5; A4 -1,2.5; A5 -0.5,2.5; A6 0,2.5; A7 0.5,2.5; A8 1,2.5; A9 1.5,2.5; A10 2,2.5; A11 2.5,2.5; B1 -2.5,2; B3 -1.5,2; B4 -1,2; B5 -0.5,2; B6 0,2; B7 0.5,2; B8 1,2; B9 1.5,2; B10 2,2; B11 2.5,2; C1 -2.5,1.5; C2 -2,1.5; C10 2,1.5; C11 2.5,1.5; D1 -2.5,1; D2 -2,1; D4 -1,1; D5 -0.5,1; D6 0,1; D7 0.5,1; D8 1,1; D10 2,1; D11 2.5,1; E1 -2.5,0.5; E2 -2,0.5; E4 -1,0.5; E8 1,0.5; E10 2,0.5; E11 2.5,0.5; F1 -2.5,0; F2 -2,0; F4 -1,0; F8 1,0; F10 2,0; F11 2.5,0; G1 -2.5,-0.5; G2 -2,-0.5; G4 -1,-0.5; G8 1,-0.5; G10 2,-0.5; G11 2.5,-0.5; H1 -2.5,-1; H2 -2,-1; H4 -1,-1; H5 -0.5,-1; H6 0,-1; H7 0.5,-1; H8 1,-1; H10 2,-1; H11 2.5,-1; J1 -2.5,-1.5; J2 -2,-1.5; J10 2,-1.5; J11 2.5,-1.5; K1 -2.5,-2; K2 -2,-2; K3 -1.5,-2; K4 -1,-2; K5 -0.5,-2; K6 0,-2; K7 0.5,-2; K8 1,-2; K9 1.5,-2; K10 2,-2; K11 2.5,-2; L1 -2.5,-2.5; L2 -2,-2.5; L3 -1.5,-2.5; L4 -1,-2.5; L5 -0.5,-2.5; L6 0,-2.5; L7 0.5,-2.5; L8 1,-2.5; L9 1.5,-2.5; L10 2,-2.5; L11 2.5,-2.5
S-PWQFN-N16-0.5 = smd 0.28 x 0.85: 1 -0.75,-1.475; 2 -0.25,-1.475; 3 0.25,-1.475; 4 0.75,-1.475; 9 0.75,1.475; 10 0.25,1.475; 11 -0.25,1.475; 12 -0.75,1.475 | smd 0.85 x 0.28: 5 1.475,-0.75; 6 1.475,-0.25; 7 1.475,0.25; 8 1.475,0.75; 13 -1.475,0.75; 14 -1.475,0.25; 15 -1.475,-0.25; 16 -1.475,-0.75 | smd 1.7 x 1.7: E 0.03,0.04
SOT23-5 = smd 0.5 x 0.8: 1 -0.95,-1.2; 2 0,-1.2; 3 0.95,-1.2; 4 0.95,1.2; 5 -0.95,1.2
R-PDSO-G8-0.65 = smd 0.45 x 1.45: 1 -0.975,-2.2; 2 -0.325,-2.2; 3 0.325,-2.2; 4 0.975,-2.2; 5 0.975,2.2; 6 0.325,2.2; 7 -0.325,2.2; 8 -0.975,2.2
TRF7960_61 = smd 0.8 x 0.3: 1 -2.5,1.75; 2 -2.5,1.25; 3 -2.5,0.75; 4 -2.5,0.25; 5 -2.5,-0.25; 6 -2.5,-0.75; 7 -2.5,-1.25; 8 -2.5,-1.75; 17 2.5,-1.75; 18 2.5,-1.25; 19 2.5,-0.75; 20 2.5,-0.25; 21 2.5,0.25; 22 2.5,0.75; 23 2.5,1.25; 24 2.5,1.75 | smd 0.3 x 0.8: 9 -1.75,-2.5; 10 -1.25,-2.5; 11 -0.75,-2.5; 12 -0.25,-2.5; 13 0.25,-2.5; 14 0.75,-2.5; 15 1.25,-2.5; 16 1.75,-2.5; 25 1.75,2.5; 26 1.25,2.5; 27 0.75,2.5; 28 0.25,2.5; 29 -0.25,2.5; 30 -0.75,2.5; 31 -1.25,2.5; 32 -1.75,2.5 | smd 3.45 x 3.45: TP 0,0
QFN-32+E-0.5 = smd 0.6 x 0.3: 1 -2.3,1.75; 2 -2.3,1.25; 3 -2.3,0.75; 4 -2.3,0.25; 5 -2.3,-0.25; 6 -2.3,-0.75; 7 -2.3,-1.25; 8 -2.3,-1.75; 17 2.3,-1.75; 18 2.3,-1.25; 19 2.3,-0.75; 20 2.3,-0.25; 21 2.3,0.25; 22 2.3,0.75; 23 2.3,1.25; 24 2.3,1.75 | smd 0.3 x 0.6: 9 -1.75,-2.3; 10 -1.25,-2.3; 11 -0.75,-2.3; 12 -0.25,-2.3; 13 0.25,-2.3; 14 0.75,-2.3; 15 1.25,-2.3; 16 1.75,-2.3; 25 1.75,2.3; 26 1.25,2.3; 27 0.75,2.3; 28 0.25,2.3; 29 -0.25,2.3; 30 -0.75,2.3; 31 -1.25,2.3; 32 -1.75,2.3 | smd 3.2 x 3.2: EXP 0,0
PW_R-PDSO-G08 = smd 0.4 x 1.2: 1 -0.975,-2.9; 2 -0.325,-2.9; 3 0.325,-2.9; 4 0.975,-2.9; 5 0.975,2.9; 6 0.325,2.9; 7 -0.325,2.9; 8 -0.975,2.9
RPM973-H11E2A = smd 0.7 x 0.8: 1 2.85,-0.8; 2 1.9,-0.8; 3 0.95,-0.8; 4 0,-0.8; 5 -0.95,-0.8; 6 -1.9,-0.8; 7 -2.85,-0.8 | smd 1.2 x 0.6: S 0.15,0.9
SOT23 = smd 0.5 x 0.8: 1 0.95,1.2; 2 -0.95,1.2; 3 0.02,-1.2
SFH7741 = smd 1.25 x 0.85: 1 -1.625,1.2; 2 -1.625,0; 3 -1.625,-1.2; 4 1.625,-1.2; 5 1.625,0; 6 1.625,1.2
QFN-16+E-0.5 = smd 0.61 x 0.28: 1 -1.355,0.75; 2 -1.355,0.25; 3 -1.355,-0.25; 4 -1.355,-0.75; 9 1.355,-0.75; 10 1.355,-0.25; 11 1.355,0.25; 12 1.355,0.75 | smd 0.28 x 0.61: 5 -0.75,-1.355; 6 -0.25,-1.355; 7 0.25,-1.355; 8 0.75,-1.355; 13 0.75,1.355; 14 0.25,1.355; 15 -0.25,1.355; 16 -0.75,1.355 | smd 1.7 x 1.7: EXP 0,0
LPCC-24 = smd 0.25 x 0.5: 1 1.25,1.85; 2 0.75,1.85; 3 0.25,1.85; 4 -0.25,1.85; 5 -0.75,1.85; 6 -1.25,1.85; 13 -1.25,-1.85; 14 -0.75,-1.85; 15 -0.25,-1.85; 16 0.25,-1.85; 17 0.75,-1.85; 18 1.25,-1.85 | smd 0.5 x 0.25: 7 -1.85,1.25; 8 -1.85,0.75; 9 -1.85,0.25; 10 -1.85,-0.25; 11 -1.85,-0.75; 12 -1.85,-1.25; 19 1.85,-1.25; 20 1.85,-0.75; 21 1.85,-0.25; 22 1.85,0.25; 23 1.85,0.75; 24 1.85,1.25 | smd 2.45 x 2.45: P 0,0
TSSOP16 = smd 0.305 x 0.991: 1 -2.275,-2.918; 2 -1.625,-2.918; 3 -0.975,-2.918; 4 -0.325,-2.918; 5 0.325,-2.918; 6 0.975,-2.918; 7 1.625,-2.918; 8 2.275,-2.918; 9 2.275,2.918; 10 1.625,2.918; 11 0.975,2.918; 12 0.325,2.918; 13 -0.325,2.918; 14 -0.975,2.918; 15 -1.625,2.918; 16 -2.275,2.918
PBGA784-N515-0.4 = smd 0.275 x 0.275: A1 -5.4,5.4; A2 -5,5.4; A3 -4.6,5.4; A4 -4.2,5.4; A5 -3.8,5.4; A6 -3.4,5.4; A7 -3,5.4; A8 -2.6,5.4; A9 -2.2,5.4; A10 -1.8,5.4; A11 -1.4,5.4; A12 -1,5.4; A13 -0.6,5.4; A14 -0.2,5.4; A15 0.2,5.4; A16 0.6,5.4; A17 1,5.4; A18 1.4,5.4; A19 1.8,5.4; A20 2.2,5.4; A21 2.6,5.4; A22 3,5.4; A23 3.4,5.4; A24 3.8,5.4; A25 4.2,5.4; A26 4.6,5.4; A27 5,5.4; A28 5.4,5.4; AA1 -5.4,-2.6; AA2 -5,-2.6; AA3 -4.6,-2.6; AA4 -4.2,-2.6; AA8 -2.6,-2.6; AA9 -2.2,-2.6; AA10 -1.8,-2.6; AA11 -1.4,-2.6; AA12 -1,-2.6; AA13 -0.6,-2.6; AA14 -0.2,-2.6; AA15 0.2,-2.6; AA16 0.6,-2.6; AA17 1,-2.6; AA18 1.4,-2.6; AA19 1.8,-2.6; AA20 2.2,-2.6; AA21 2.6,-2.6; AA25 4.2,-2.6; AA26 4.6,-2.6; AA27 5,-2.6; AA28 5.4,-2.6; AB1 -5.4,-3; AB2 -5,-3; AB3 -4.6,-3; AB4 -4.2,-3; AB25 4.2,-3; AB26 4.6,-3; AB27 5,-3; AB28 5.4,-3; AC1 -5.4,-3.4; AC2 -5,-3.4; AC3 -4.6,-3.4; AC4 -4.2,-3.4; AC25 4.2,-3.4; AC26 4.6,-3.4; AC27 5,-3.4; AC28 5.4,-3.4; AD1 -5.4,-3.8; AD2 -5,-3.8; AD3 -4.6,-3.8; AD4 -4.2,-3.8; AD25 4.2,-3.8; AD26 4.6,-3.8; AD27 5,-3.8; AD28 5.4,-3.8; AE1 -5.4,-4.2; AE2 -5,-4.2; AE3 -4.6,-4.2; AE4 -4.2,-4.2; AE5 -3.8,-4.2; AE6 -3.4,-4.2; AE7 -3,-4.2; AE8 -2.6,-4.2; AE9 -2.2,-4.2; AE10 -1.8,-4.2; AE11 -1.4,-4.2; AE12 -1,-4.2; AE13 -0.6,-4.2; AE14 -0.2,-4.2; AE15 0.2,-4.2; AE16 0.6,-4.2; AE17 1,-4.2; AE18 1.4,-4.2; AE19 1.8,-4.2; AE20 2.2,-4.2; AE21 2.6,-4.2; AE22 3,-4.2; AE23 3.4,-4.2; AE24 3.8,-4.2; AE25 4.2,-4.2; AE26 4.6,-4.2; AE27 5,-4.2; AE28 5.4,-4.2; AF1 -5.4,-4.6; AF2 -5,-4.6; AF3 -4.6,-4.6; AF4 -4.2,-4.6; AF5 -3.8,-4.6; AF6 -3.4,-4.6; AF7 -3,-4.6; AF8 -2.6,-4.6; AF9 -2.2,-4.6; AF10 -1.8,-4.6; AF11 -1.4,-4.6; AF12 -1,-4.6; AF13 -0.6,-4.6; AF14 -0.2,-4.6; AF15 0.2,-4.6; AF16 0.6,-4.6; AF17 1,-4.6; AF18 1.4,-4.6; AF19 1.8,-4.6; AF20 2.2,-4.6; AF21 2.6,-4.6; AF22 3,-4.6; AF23 3.4,-4.6; AF24 3.8,-4.6; AF25 4.2,-4.6; AF26 4.6,-4.6; AF27 5,-4.6; AF28 5.4,-4.6; AG1 -5.4,-5; AG2 -5,-5; AG3 -4.6,-5; AG4 -4.2,-5; AG5 -3.8,-5; AG6 -3.4,-5; AG7 -3,-5; AG8 -2.6,-5; AG9 -2.2,-5; AG10 -1.8,-5; AG11 -1.4,-5; AG12 -1,-5; AG13 -0.6,-5; AG14 -0.2,-5; AG15 0.2,-5; AG16 0.6,-5; AG17 1,-5; AG18 1.4,-5; AG19 1.8,-5; AG20 2.2,-5; AG21 2.6,-5; AG22 3,-5; AG23 3.4,-5; AG24 3.8,-5; AG25 4.2,-5; AG26 4.6,-5; AG27 5,-5; AG28 5.4,-5; AH1 -5.4,-5.4; AH2 -5,-5.4; AH3 -4.6,-5.4; AH4 -4.2,-5.4; AH5 -3.8,-5.4; AH6 -3.4,-5.4; AH7 -3,-5.4; AH8 -2.6,-5.4; AH9 -2.2,-5.4; AH10 -1.8,-5.4; AH11 -1.4,-5.4; AH12 -1,-5.4; AH13 -0.6,-5.4; AH14 -0.2,-5.4; AH15 0.2,-5.4; AH16 0.6,-5.4; AH17 1,-5.4; AH18 1.4,-5.4; AH19 1.8,-5.4; AH20 2.2,-5.4; AH21 2.6,-5.4; AH22 3,-5.4; AH23 3.4,-5.4; AH24 3.8,-5.4; AH25 4.2,-5.4; AH26 4.6,-5.4; AH27 5,-5.4; AH28 5.4,-5.4; B1 -5.4,5; B2 -5,5; B3 -4.6,5; B4 -4.2,5; B5 -3.8,5; B6 -3.4,5; B7 -3,5; B8 -2.6,5; B9 -2.2,5; B10 -1.8,5; B11 -1.4,5; B12 -1,5; B13 -0.6,5; B14 -0.2,5; B15 0.2,5; B16 0.6,5; B17 1,5; B18 1.4,5; B19 1.8,5; B20 2.2,5; B21 2.6,5; B22 3,5; B23 3.4,5; B24 3.8,5; B25 4.2,5; B26 4.6,5; B27 5,5; B28 5.4,5; C1 -5.4,4.6; C2 -5,4.6; C3 -4.6,4.6; C4 -4.2,4.6; C5 -3.8,4.6; C6 -3.4,4.6; C7 -3,4.6; C8 -2.6,4.6; C9 -2.2,4.6; C10 -1.8,4.6; C11 -1.4,4.6; C12 -1,4.6; C13 -0.6,4.6; C14 -0.2,4.6; C15 0.2,4.6; C16 0.6,4.6; C17 1,4.6; C18 1.4,4.6; C19 1.8,4.6; C20 2.2,4.6; C21 2.6,4.6; C22 3,4.6; C23 3.4,4.6; C24 3.8,4.6; C25 4.2,4.6; C26 4.6,4.6; C27 5,4.6; C28 5.4,4.6; D1 -5.4,4.2; D2 -5,4.2; D3 -4.6,4.2; D4 -4.2,4.2; D5 -3.8,4.2; D6 -3.4,4.2; D7 -3,4.2; D8 -2.6,4.2; D9 -2.2,4.2; D10 -1.8,4.2; D11 -1.4,4.2; D12 -1,4.2; D13 -0.6,4.2; D14 -0.2,4.2; D15 0.2,4.2; D16 0.6,4.2; D17 1,4.2; D18 1.4,4.2; D19 1.8,4.2; D20 2.2,4.2; D21 2.6,4.2; D22 3,4.2; D23 3.4,4.2; D24 3.8,4.2; D25 4.2,4.2; D26 4.6,4.2; D27 5,4.2; D28 5.4,4.2; E1 -5.4,3.8; E2 -5,3.8; E3 -4.6,3.8; E4 -4.2,3.8; E25 4.2,3.8; E26 4.6,3.8; E27 5,3.8; E28 5.4,3.8; F1 -5.4,3.4; F2 -5,3.4; F3 -4.6,3.4; F4 -4.2,3.4; F25 4.2,3.4; F26 4.6,3.4; F27 5,3.4; F28 5.4,3.4; G1 -5.4,3; G2 -5,3; G3 -4.6,3; G4 -4.2,3; G25 4.2,3; G26 4.6,3; G27 5,3; G28 5.4,3; H1 -5.4,2.6; H2 -5,2.6; H3 -4.6,2.6; H4 -4.2,2.6; H9 -2.2,2.6; H10 -1.8,2.6; H11 -1.4,2.6; H12 -1,2.6; H13 -0.6,2.6; H14 -0.2,2.6; H15 0.2,2.6; H16 0.6,2.6; H17 1,2.6; H18 1.4,2.6; H19 1.8,2.6; H20 2.2,2.6; H21 2.6,2.6; H25 4.2,2.6; H26 4.6,2.6; H27 5,2.6; H28 5.4,2.6; J1 -5.4,2.2; J2 -5,2.2; J3 -4.6,2.2; J4 -4.2,2.2; J8 -2.6,2.2; J9 -2.2,2.2; J10 -1.8,2.2; J11 -1.4,2.2; J12 -1,2.2; J13 -0.6,2.2; J14 -0.2,2.2; J15 0.2,2.2; J16 0.6,2.2; J17 1,2.2; J18 1.4,2.2; J19 1.8,2.2; J20 2.2,2.2; J21 2.6,2.2; J25 4.2,2.2; J26 4.6,2.2; J27 5,2.2; J28 5.4,2.2; K1 -5.4,1.8; K2 -5,1.8; K3 -4.6,1.8; K4 -4.2,1.8; K8 -2.6,1.8; K9 -2.2,1.8; K10 -1.8,1.8; K11 -1.4,1.8; K12 -1,1.8; K13 -0.6,1.8; K14 -0.2,1.8; K15 0.2,1.8; K16 0.6,1.8; K17 1,1.8; K18 1.4,1.8; K19 1.8,1.8; K20 2.2,1.8; K21 2.6,1.8; K25 4.2,1.8; K26 4.6,1.8; K27 5,1.8; K28 5.4,1.8; L1 -5.4,1.4; L2 -5,1.4; L3 -4.6,1.4; L4 -4.2,1.4; L8 -2.6,1.4; L9 -2.2,1.4; L10 -1.8,1.4; L19 1.8,1.4; L20 2.2,1.4; L21 2.6,1.4; L25 4.2,1.4; L26 4.6,1.4; L27 5,1.4; L28 5.4,1.4; M1 -5.4,1; M2 -5,1; M3 -4.6,1; M4 -4.2,1; M8 -2.6,1; M9 -2.2,1; M10 -1.8,1; M19 1.8,1; M20 2.2,1; M21 2.6,1; M25 4.2,1; M26 4.6,1; M27 5,1; M28 5.4,1; N1 -5.4,0.6; N2 -5,0.6; N3 -4.6,0.6; N4 -4.2,0.6; N8 -2.6,0.6; N9 -2.2,0.6; N10 -1.8,0.6; N19 1.8,0.6; N20 2.2,0.6; N21 2.6,0.6; N25 4.2,0.6; N26 4.6,0.6; N27 5,0.6; N28 5.4,0.6; P1 -5.4,0.2; P2 -5,0.2; P3 -4.6,0.2; P4 -4.2,0.2; P8 -2.6,0.2; P9 -2.2,0.2; P10 -1.8,0.2; P19 1.8,0.2; P20 2.2,0.2; P21 2.6,0.2; P25 4.2,0.2; P26 4.6,0.2; P27 5,0.2; P28 5.4,0.2; R1 -5.4,-0.2; R2 -5,-0.2; R3 -4.6,-0.2; R4 -4.2,-0.2; R8 -2.6,-0.2; R9 -2.2,-0.2; R10 -1.8,-0.2; R19 1.8,-0.2; R20 2.2,-0.2; R21 2.6,-0.2; R25 4.2,-0.2; R26 4.6,-0.2; R27 5,-0.2; R28 5.4,-0.2; T1 -5.4,-0.6; T2 -5,-0.6; T3 -4.6,-0.6; T4 -4.2,-0.6; T8 -2.6,-0.6; T9 -2.2,-0.6; T10 -1.8,-0.6; T19 1.8,-0.6; T20 2.2,-0.6; T21 2.6,-0.6; T25 4.2,-0.6; T26 4.6,-0.6; T27 5,-0.6; T28 5.4,-0.6; U1 -5.4,-1; U2 -5,-1; U3 -4.6,-1; U4 -4.2,-1; U8 -2.6,-1; U9 -2.2,-1; U10 -1.8,-1; U19 1.8,-1; U20 2.2,-1; U21 2.6,-1; U25 4.2,-1; U26 4.6,-1; U27 5,-1; U28 5.4,-1; V1 -5.4,-1.4; V2 -5,-1.4; V3 -4.6,-1.4; V4 -4.2,-1.4; V8 -2.6,-1.4; V9 -2.2,-1.4; V10 -1.8,-1.4; V19 1.8,-1.4; V20 2.2,-1.4; V21 2.6,-1.4; V25 4.2,-1.4; V26 4.6,-1.4; V27 5,-1.4; V28 5.4,-1.4; W1 -5.4,-1.8; W2 -5,-1.8; W3 -4.6,-1.8; W4 -4.2,-1.8; W8 -2.6,-1.8; W9 -2.2,-1.8; W10 -1.8,-1.8; W11 -1.4,-1.8; W12 -1,-1.8; W13 -0.6,-1.8; W14 -0.2,-1.8; W15 0.2,-1.8; W16 0.6,-1.8; W17 1,-1.8; W18 1.4,-1.8; W19 1.8,-1.8; W20 2.2,-1.8; W21 2.6,-1.8; W25 4.2,-1.8; W26 4.6,-1.8; W27 5,-1.8; W28 5.4,-1.8; Y1 -5.4,-2.2; Y2 -5,-2.2; Y3 -4.6,-2.2; Y4 -4.2,-2.2; Y8 -2.6,-2.2; Y9 -2.2,-2.2; Y10 -1.8,-2.2; Y11 -1.4,-2.2; Y12 -1,-2.2; Y13 -0.6,-2.2; Y14 -0.2,-2.2; Y15 0.2,-2.2; Y16 0.6,-2.2; Y17 1,-2.2; Y18 1.4,-2.2; Y19 1.8,-2.2; Y20 2.2,-2.2; Y21 2.6,-2.2; Y25 4.2,-2.2; Y26 4.6,-2.2; Y27 5,-2.2; Y28 5.4,-2.2
EMMC-BGA-N169-0.5 = smd 0.275 x 0.275: A4 1.75,-6.75; A6 0.75,-6.75; A9 -0.75,-6.75; A11 -1.75,-6.75; AA1 3.25,3.25; AA2 2.75,3.25; AA3 2.25,3.25; AA4 1.75,3.25; AA5 1.25,3.25; AA6 0.75,3.25; AA7 0.25,3.25; AA8 -0.25,3.25; AA9 -0.75,3.25; AA10 -1.25,3.25; AA11 -1.75,3.25; AA12 -2.25,3.25; AA13 -2.75,3.25; AA14 -3.25,3.25; AE1 3.25,5.25; AE14 -3.25,5.25; AG2 2.75,6.25; AG13 -2.75,6.25; AH4 1.75,6.75; AH6 0.75,6.75; AH9 -0.75,6.75; AH11 -1.75,6.75; B2 2.75,-6.25; B13 -2.75,-6.25; D1 3.25,-5.25; D14 -3.25,-5.25; H1 3.25,-3.25; H2 2.75,-3.25; H3 2.25,-3.25; H4 1.75,-3.25; H5 1.25,-3.25; H6 0.75,-3.25; H7 0.25,-3.25; H8 -0.25,-3.25; H9 -0.75,-3.25; H10 -1.25,-3.25; H11 -1.75,-3.25; H12 -2.25,-3.25; H13 -2.75,-3.25; H14 -3.25,-3.25; J1 3.25,-2.75; J2 2.75,-2.75; J3 2.25,-2.75; J4 1.75,-2.75; J5 1.25,-2.75; J6 0.75,-2.75; J7 0.25,-2.75; J8 -0.25,-2.75; J9 -0.75,-2.75; J10 -1.25,-2.75; J11 -1.75,-2.75; J12 -2.25,-2.75; J13 -2.75,-2.75; J14 -3.25,-2.75; K1 3.25,-2.25; K2 2.75,-2.25; K3 2.25,-2.25; K4 1.75,-2.25; K5 1.25,-2.25; K6 0.75,-2.25; K7 0.25,-2.25; K8 -0.25,-2.25; K9 -0.75,-2.25; K10 -1.25,-2.25; K11 -1.75,-2.25; K12 -2.25,-2.25; K13 -2.75,-2.25; K14 -3.25,-2.25; L1 3.25,-1.75; L2 2.75,-1.75; L3 2.25,-1.75; L4 1.75,-1.75; L12 -2.25,-1.75; L13 -2.75,-1.75; L14 -3.25,-1.75; M1 3.25,-1.25; M2 2.75,-1.25; M3 2.25,-1.25; M5 1.25,-1.25; M6 0.75,-1.25; M7 0.25,-1.25; M8 -0.25,-1.25; M9 -0.75,-1.25; M10 -1.25,-1.25; M12 -2.25,-1.25; M13 -2.75,-1.25; M14 -3.25,-1.25; N1 3.25,-0.75; N2 2.75,-0.75; N3 2.25,-0.75; N5 1.25,-0.75; N10 -1.25,-0.75; N12 -2.25,-0.75; N13 -2.75,-0.75; N14 -3.25,-0.75; P1 3.25,-0.25; P2 2.75,-0.25; P3 2.25,-0.25; P5 1.25,-0.25; P10 -1.25,-0.25; P12 -2.25,-0.25; P13 -2.75,-0.25; P14 -3.25,-0.25; R1 3.25,0.25; R2 2.75,0.25; R3 2.25,0.25; R5 1.25,0.25; R10 -1.25,0.25; R12 -2.25,0.25; R13 -2.75,0.25; R14 -3.25,0.25; T1 3.25,0.75; T2 2.75,0.75; T3 2.25,0.75; T5 1.25,0.75; T10 -1.25,0.75; T12 -2.25,0.75; T13 -2.75,0.75; T14 -3.25,0.75; U1 3.25,1.25; U2 2.75,1.25; U3 2.25,1.25; U5 1.25,1.25; U6 0.75,1.25; U7 0.25,1.25; U8 -0.25,1.25; U9 -0.75,1.25; U10 -1.25,1.25; U12 -2.25,1.25; U13 -2.75,1.25; U14 -3.25,1.25; V1 3.25,1.75; V2 2.75,1.75; V3 2.25,1.75; V12 -2.25,1.75; V13 -2.75,1.75; V14 -3.25,1.75; W1 3.25,2.25; W2 2.75,2.25; W3 2.25,2.25; W4 1.75,2.25; W5 1.25,2.25; W6 0.75,2.25; W7 0.25,2.25; W8 -0.25,2.25; W9 -0.75,2.25; W10 -1.25,2.25; W11 -1.75,2.25; W12 -2.25,2.25; W13 -2.75,2.25; W14 -3.25,2.25; Y1 3.25,2.75; Y2 2.75,2.75; Y3 2.25,2.75; Y4 1.75,2.75; Y5 1.25,2.75; Y6 0.75,2.75; Y7 0.25,2.75; Y8 -0.25,2.75; Y9 -0.75,2.75; Y10 -1.25,2.75; Y11 -1.75,2.75; Y12 -2.25,2.75; Y13 -2.75,2.75; Y14 -3.25,2.75
WLCSP25-N25-0.4 = smd 0.275 x 0.275: A1 0.8,-0.8; A2 0.4,-0.8; A3 0,-0.8; A4 -0.4,-0.8; A5 -0.8,-0.8; B1 0.8,-0.4; B2 0.4,-0.4; B3 0,-0.4; B4 -0.4,-0.4; B5 -0.8,-0.4; C1 0.8,0; C2 0.4,0; C3 0,0; C4 -0.4,0; C5 -0.8,0; D1 0.8,0.4; D2 0.4,0.4; D3 0,0.4; D4 -0.4,0.4; D5 -0.8,0.4; E1 0.8,0.8; E2 0.4,0.8; E3 0,0.8; E4 -0.4,0.8; E5 -0.8,0.8
PBGA256-N213-0.4 = smd 0.275 x 0.275: A1 3,-3; A2 2.6,-3; A3 2.2,-3; A4 1.8,-3; A6 1,-3; A7 0.6,-3; A10 -0.6,-3; A11 -1,-3; A13 -1.8,-3; A14 -2.2,-3; A15 -2.6,-3; A16 -3,-3; B1 3,-2.6; B2 2.6,-2.6; B3 2.2,-2.6; B4 1.8,-2.6; B5 1.4,-2.6; B6 1,-2.6; B7 0.6,-2.6; B8 0.2,-2.6; B9 -0.2,-2.6; B10 -0.6,-2.6; B11 -1,-2.6; B12 -1.4,-2.6; B13 -1.8,-2.6; B14 -2.2,-2.6; B15 -2.6,-2.6; B16 -3,-2.6; C1 3,-2.2; C2 2.6,-2.2; C3 2.2,-2.2; C4 1.8,-2.2; C5 1.4,-2.2; C6 1,-2.2; C7 0.6,-2.2; C8 0.2,-2.2; C9 -0.2,-2.2; C10 -0.6,-2.2; C11 -1,-2.2; C12 -1.4,-2.2; C13 -1.8,-2.2; C14 -2.2,-2.2; C15 -2.6,-2.2; C16 -3,-2.2; D1 3,-1.8; D2 2.6,-1.8; D3 2.2,-1.8; D4 1.8,-1.8; D5 1.4,-1.8; D6 1,-1.8; D7 0.6,-1.8; D8 0.2,-1.8; D9 -0.2,-1.8; D10 -0.6,-1.8; D11 -1,-1.8; D12 -1.4,-1.8; D13 -1.8,-1.8; D14 -2.2,-1.8; D15 -2.6,-1.8; D16 -3,-1.8; E2 2.6,-1.4; E3 2.2,-1.4; E4 1.8,-1.4; E5 1.4,-1.4; E13 -1.8,-1.4; E14 -2.2,-1.4; E15 -2.6,-1.4; F1 3,-1; F2 2.6,-1; F3 2.2,-1; F4 1.8,-1; F7 0.6,-1; F8 0.2,-1; F9 -0.2,-1; F10 -0.6,-1; F13 -1.8,-1; F14 -2.2,-1; F15 -2.6,-1; F16 -3,-1; G1 3,-0.6; G2 2.6,-0.6; G3 2.2,-0.6; G4 1.8,-0.6; G6 1,-0.6; G7 0.6,-0.6; G8 0.2,-0.6; G9 -0.2,-0.6; G10 -0.6,-0.6; G11 -1,-0.6; G13 -1.8,-0.6; G14 -2.2,-0.6; G15 -2.6,-0.6; G16 -3,-0.6; H2 2.6,-0.2; H3 2.2,-0.2; H4 1.8,-0.2; H6 1,-0.2; H7 0.6,-0.2; H8 0.2,-0.2; H9 -0.2,-0.2; H10 -0.6,-0.2; H11 -1,-0.2; H13 -1.8,-0.2; H14 -2.2,-0.2; H15 -2.6,-0.2; J2 2.6,0.2; J3 2.2,0.2; J4 1.8,0.2; J6 1,0.2; J7 0.6,0.2; J8 0.2,0.2; J9 -0.2,0.2; J10 -0.6,0.2; J11 -1,0.2; J13 -1.8,0.2; J14 -2.2,0.2; J15 -2.6,0.2; K1 3,0.6; K2 2.6,0.6; K3 2.2,0.6; K4 1.8,0.6; K6 1,0.6; K7 0.6,0.6; K8 0.2,0.6; K9 -0.2,0.6; K10 -0.6,0.6; K11 -1,0.6; K13 -1.8,0.6; K14 -2.2,0.6; K15 -2.6,0.6; K16 -3,0.6; L1 3,1; L2 2.6,1; L3 2.2,1; L4 1.8,1; L7 0.6,1; L8 0.2,1; L9 -0.2,1; L10 -0.6,1; L13 -1.8,1; L14 -2.2,1; L15 -2.6,1; L16 -3,1; M2 2.6,1.4; M3 2.2,1.4; M4 1.8,1.4; M13 -1.8,1.4; M14 -2.2,1.4; M15 -2.6,1.4; N1 3,1.8; N2 2.6,1.8; N3 2.2,1.8; N4 1.8,1.8; N5 1.4,1.8; N6 1,1.8; N7 0.6,1.8; N8 0.2,1.8; N9 -0.2,1.8; N10 -0.6,1.8; N11 -1,1.8; N12 -1.4,1.8; N13 -1.8,1.8; N14 -2.2,1.8; N15 -2.6,1.8; N16 -3,1.8; P1 3,2.2; P2 2.6,2.2; P3 2.2,2.2; P4 1.8,2.2; P5 1.4,2.2; P6 1,2.2; P7 0.6,2.2; P8 0.2,2.2; P9 -0.2,2.2; P10 -0.6,2.2; P11 -1,2.2; P12 -1.4,2.2; P13 -1.8,2.2; P14 -2.2,2.2; P15 -2.6,2.2; P16 -3,2.2; R1 3,2.6; R2 2.6,2.6; R3 2.2,2.6; R4 1.8,2.6; R5 1.4,2.6; R6 1,2.6; R7 0.6,2.6; R8 0.2,2.6; R9 -0.2,2.6; R10 -0.6,2.6; R11 -1,2.6; R12 -1.4,2.6; R13 -1.8,2.6; R14 -2.2,2.6; R15 -2.6,2.6; R16 -3,2.6; T1 3,3; T2 2.6,3; T3 2.2,3; T4 1.8,3; T6 1,3; T7 0.6,3; T10 -0.6,3; T11 -1,3; T13 -1.8,3; T14 -2.2,3; T15 -2.6,3; T16 -3,3
R-XBGA-N12-0.5 = smd 0.25 x 0.25: A1 -0.75,-0.5; A2 -0.75,0; A3 -0.75,0.5; B1 -0.25,-0.5; B2 -0.25,0; B3 -0.25,0.5; C1 0.25,-0.5; C2 0.25,0; C3 0.25,0.5; D1 0.75,-0.5; D2 0.75,0; D3 0.75,0.5
QFN-24+E-0.5 = smd 0.65 x 0.3: 1 -2,1.25; 2 -2,0.75; 3 -2,0.25; 4 -2,-0.25; 5 -2,-0.75; 6 -2,-1.25; 13 2,-1.25; 14 2,-0.75; 15 2,-0.25; 16 2,0.25; 17 2,0.75; 18 2,1.25 | smd 0.3 x 0.65: 7 -1.25,-2; 8 -0.75,-2; 9 -0.25,-2; 10 0.25,-2; 11 0.75,-2; 12 1.25,-2; 19 1.25,2; 20 0.75,2; 21 0.25,2; 22 -0.25,2; 23 -0.75,2; 24 -1.25,2 | smd 2.7 x 2.7: EXP 0,0
YZR0036 = smd 0.3 x 0.3: A1 1.25,-1.25; A2 0.75,-1.25; A3 0.25,-1.25; A4 -0.25,-1.25; A5 -0.75,-1.25; A6 -1.25,-1.25; B1 1.25,-0.75; B2 0.75,-0.75; B3 0.25,-0.75; B4 -0.25,-0.75; B5 -0.75,-0.75; B6 -1.25,-0.75; C1 1.25,-0.25; C2 0.75,-0.25; C3 0.25,-0.25; C4 -0.25,-0.25; C5 -0.75,-0.25; C6 -1.25,-0.25; D1 1.25,0.25; D2 0.75,0.25; D3 0.25,0.25; D4 -0.25,0.25; D5 -0.75,0.25; D6 -1.25,0.25; E1 1.25,0.75; E2 0.75,0.75; E3 0.25,0.75; E4 -0.25,0.75; E5 -0.75,0.75; E6 -1.25,0.75; F1 1.25,1.25; F2 0.75,1.25; F3 0.25,1.25; F4 -0.25,1.25; F5 -0.75,1.25; F6 -1.25,1.25
SON-3X3 = smd 0.35 x 0.9: 1 -0.975,-1.475; 2 -0.325,-1.475; 3 0.325,-1.475; 4 0.975,-1.475; 5 0.975,1.475; 6 0.325,1.475; 7 -0.325,1.475; 8 -0.975,1.475 | smd 1.75 x 1.5: 9 0,0 | smd 1.02 x 0.28: 10 -1.38,0.32; 11 1.38,0.32; 12 1.38,-0.32; 13 -1.38,-0.32
PREC-MICRO-304-106 = smd 1.4 x 1.8: 1 0.7,1.45; 2 0.7,-1.45 | smd 4.7 x 4.7: SHIELD 4.55,0
POGO-TH-0965-0-15-20-80-14-11-0 = drill 1.6 pad 2.5: 1 0,0
XO-2016 = smd 0.75 x 0.7: 1 -0.675,-0.65; 2 0.675,-0.65; 3 0.675,0.65; 4 -0.675,0.65
XO-3225 = smd 1.1 x 1: 1 -0.925,-0.725; 2 0.925,-0.725; 3 0.925,0.725; 4 -0.925,0.725